# Altium project MC Alarm.PrjPcb (part 1 of 2)
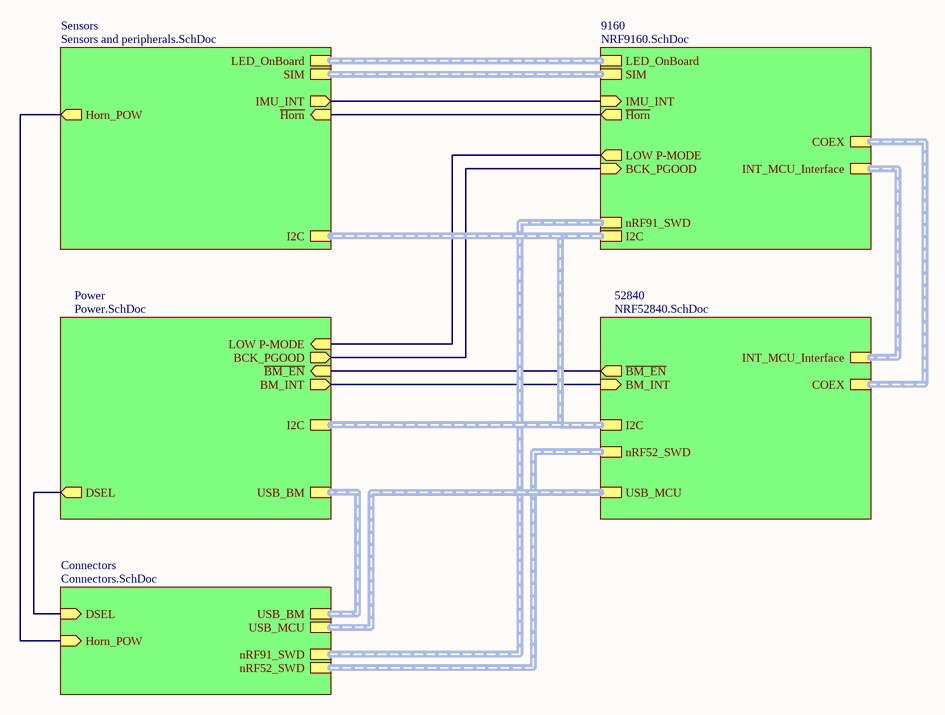
[diagram p0: Main.SchDoc]
6 sheets, 176 parts. Net scope: hierarchical (ports join the sheet entries above them; power ports are global).
Board files: PCB.PcbDoc, PCB - v2.PcbDoc, PCB - v3.PcbDoc, PCB - v4.PcbDoc
Sheets:
  Main.SchDoc
    Power = Power.SchDoc
    9160 = NRF9160.SchDoc
    52840 = NRF52840.SchDoc
    Sensors = Sensors and peripherals.SchDoc
    Connectors = Connectors.SchDoc

## Sheet Main.SchDoc
size A4; CompanyName: Motonaut Electronics; DrawnBy: Simon; SheetNumber: 1; SheetTotal: 6

### Sub-sheets
9160 = NRF9160.SchDoc: I2C (harness I2C), nRF91_SWD (harness SWD), LED_OnBoard (harness LED_CTRL), ~{Horn} (out), COEX (harness COEX), IMU_INT (in), SIM (harness SIM), LOW P-MODE (out), BCK_PGOOD (in), INT_MCU_Interface (harness USB)
52840 = NRF52840.SchDoc: I2C (harness I2C), USB_MCU (harness USB), nRF52_SWD (harness SWD), COEX (harness COEX), INT_MCU_Interface (harness USB), BM_INT (in), ~{BM_EN} (out)
Connectors = Connectors.SchDoc: nRF52_SWD (harness SWD), nRF91_SWD (harness SWD), Horn_POW (in), USB_BM (harness USB), USB_MCU (harness USB), DSEL (in)
Power = Power.SchDoc: I2C (harness I2C), LOW P-MODE (in), BCK_PGOOD (out), ~{BM_EN} (in), BM_INT (out), USB_BM (harness USB), DSEL (out)
Sensors = Sensors and peripherals.SchDoc: LED_OnBoard (harness LED_CTRL), ~{Horn} (in), IMU_INT (out), SIM (harness SIM), I2C (harness I2C), Horn_POW (out)

### Nets
~{BM_EN}: sheet Power/~{BM_EN}, sheet 52840/~{BM_EN}
BCK P_GOOD: sheet Power/BCK_PGOOD, sheet 9160/BCK_PGOOD
BM_INT: sheet Power/BM_INT, sheet 52840/BM_INT
DSEL: sheet Power/DSEL, sheet Connectors/DSEL
~{Horn}: sheet 9160/~{Horn}, sheet Sensors/~{Horn}
INT_IMU: sheet 9160/IMU_INT, sheet Sensors/IMU_INT
LOW P-MODE: sheet Power/LOW P-MODE, sheet 9160/LOW P-MODE
NetE1_A1: sheet Sensors/Horn_POW, sheet Connectors/Horn_POW

### Buses and harness runs
harness sheet 9160/COEX = sheet 52840/COEX
harness sheet 9160/I2C = sheet 52840/I2C = sheet Power/I2C = sheet Sensors/I2C
harness sheet 9160/INT_MCU_Interface = sheet 52840/INT_MCU_Interface
harness sheet 9160/LED_OnBoard = sheet Sensors/LED_OnBoard
harness sheet 9160/nRF91_SWD = sheet Connectors/nRF91_SWD
harness sheet 9160/SIM = sheet Sensors/SIM
harness sheet 52840/nRF52_SWD = sheet Connectors/nRF52_SWD
harness sheet 52840/USB_MCU = sheet Connectors/USB_MCU
harness sheet Connectors/USB_BM = sheet Power/USB_BM

## Sheet Power.SchDoc: OnTrack Power
size A3; Date: 2022-06; DrawnBy: Simon Björklund; Engineer: Simon Björklund; Organization: ETA; Revision: 3; SheetNumber: 3; SheetTotal: 6
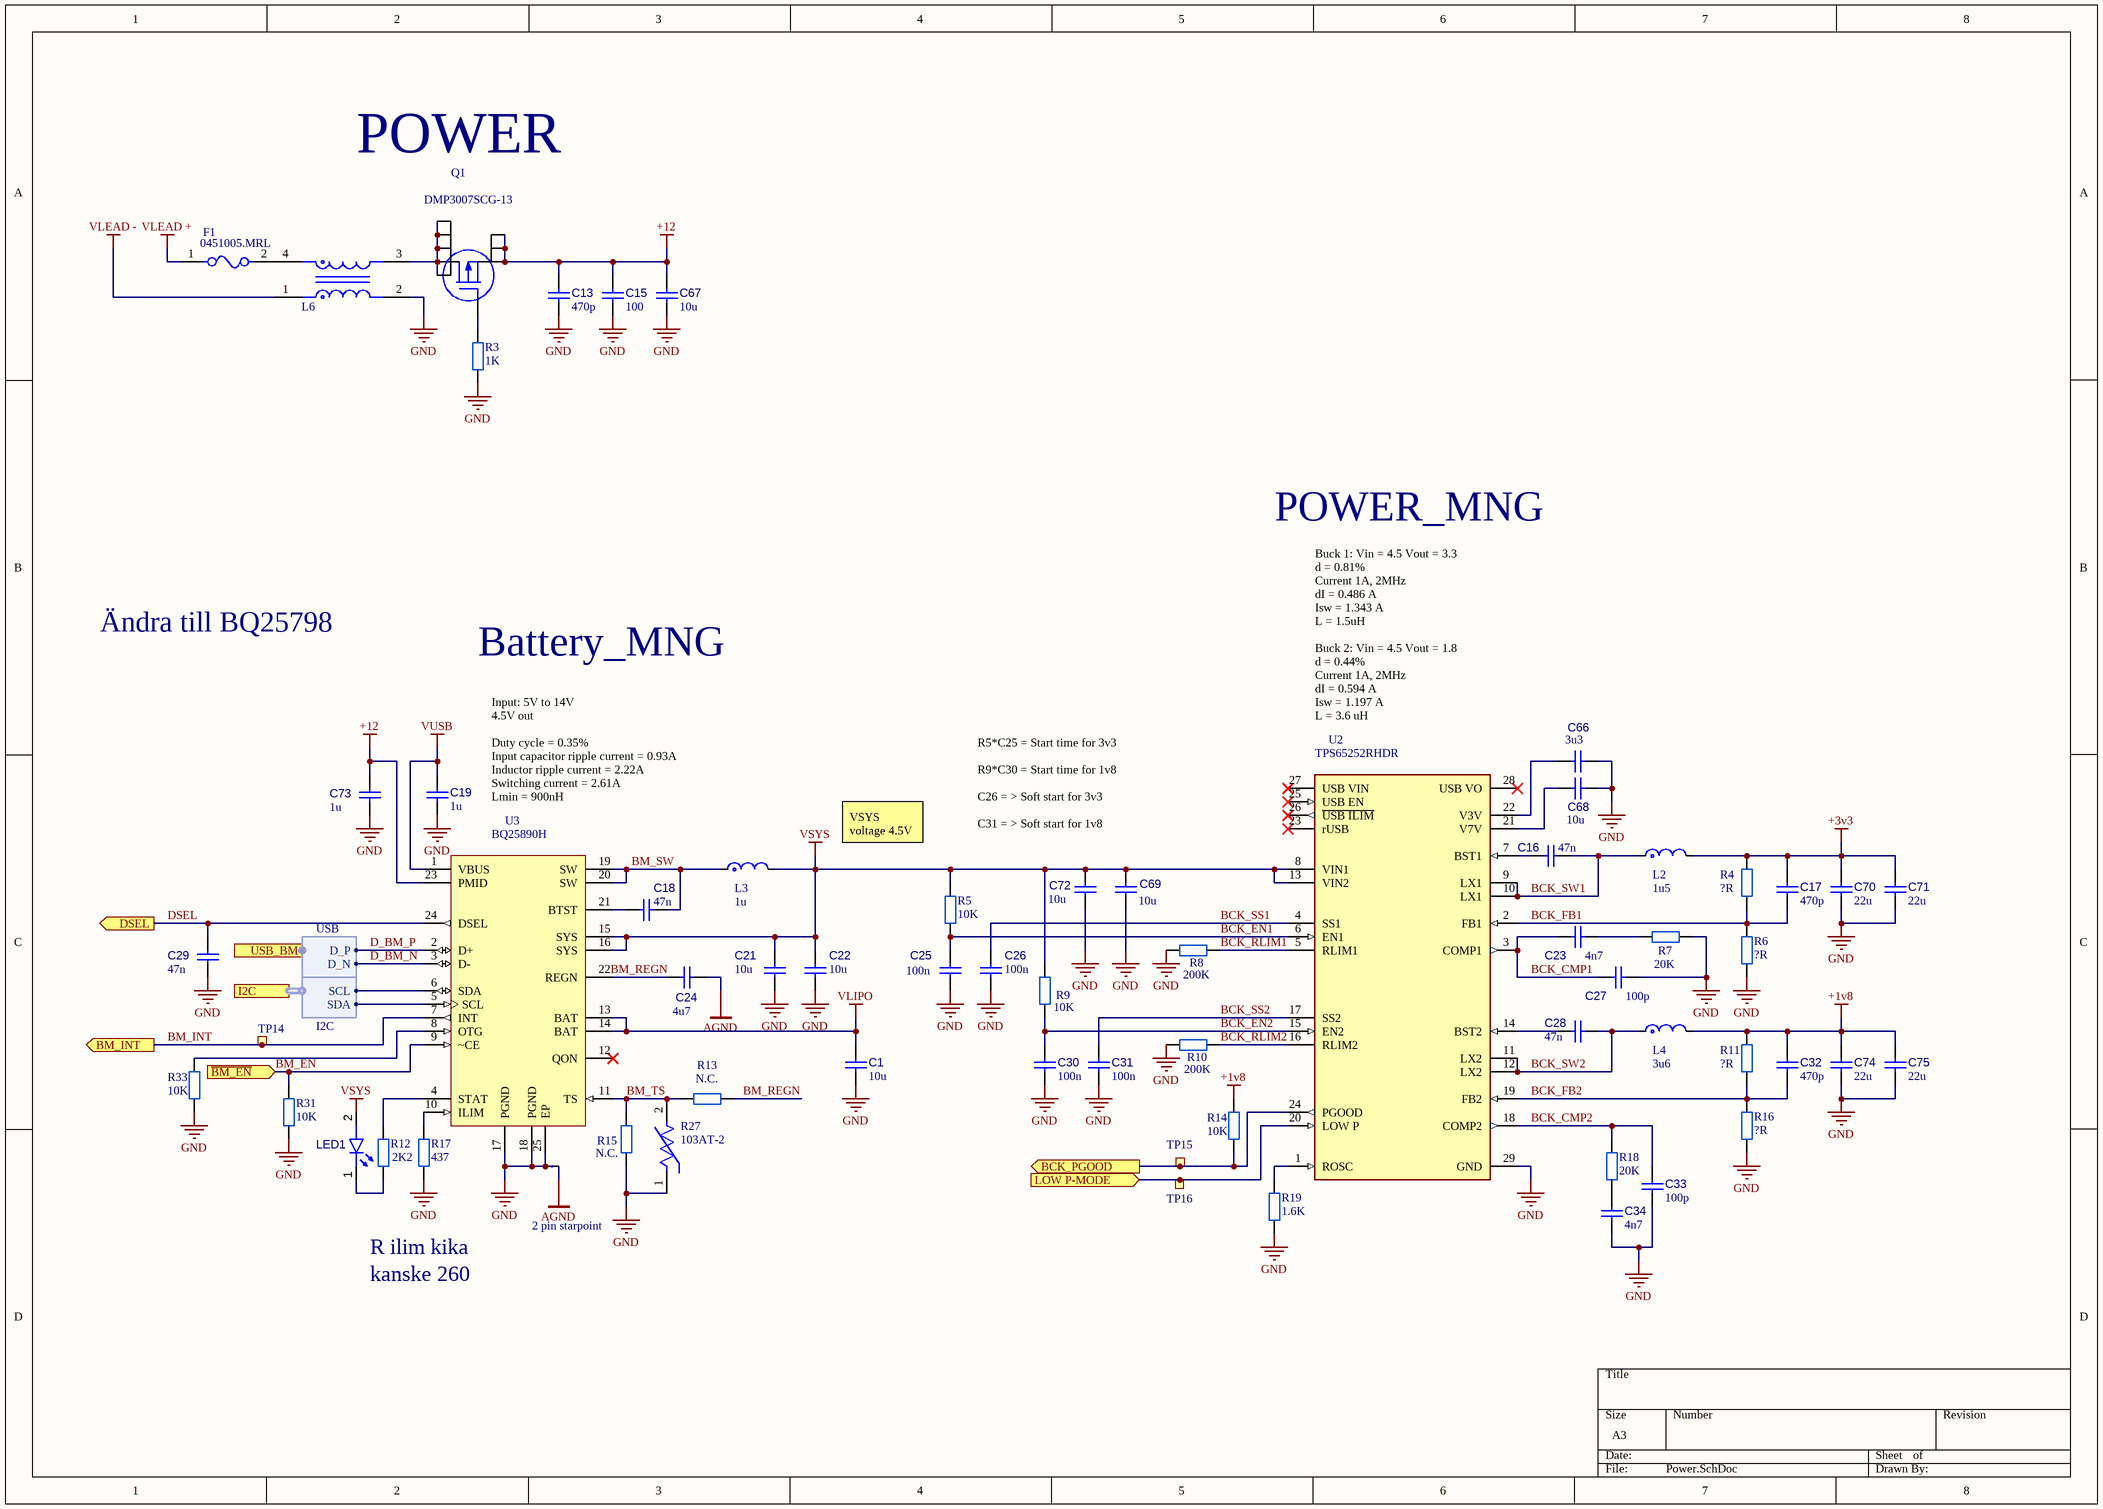
[diagram p1: Power.SchDoc]

### Parts
C1  value 10u  [CAPC1608X90X40LL10T20 HD]  (hidden comment: Capacitor 0603)
C13  value 470p  [CAPC2013X95X50LL10T25 HD]  (hidden comment: Capacitor 0805)
C15  value 100  [CAPC1608X90X40LL10T20 HD]  (hidden comment: Capacitor 0603)
C16  value 47n  [CAPC1005X55X25LL05T10 HD]  (hidden comment: Capacitor 0402)
C17  value 470p  [CAPC1005X55X25LL05T10 HD]  (hidden comment: Capacitor 0402)
C18  value 47n  [CAPC1005X55X25LL05T10 HD]  (hidden comment: Capacitor 0402)
C19  value 1u  [CAPC1005X55X25LL05T10 HD]  (hidden comment: Capacitor 0402)
C21  value 10u  [CAPC1608X90X40LL10T20 HD]  (hidden comment: Capacitor 0603)
C22  value 10u  [CAPC1608X90X40LL10T20 HD]  (hidden comment: Capacitor 0603)
C23  value 4n7  [CAPC1005X55X25LL05T10 HD]  (hidden comment: Capacitor 0402)
C24  value 4u7  [CAPC1608X90X40LL10T20 HD]  (hidden comment: Capacitor 0603)
C25  value 100n  [CAPC1005X55X25LL05T10 HD]  (hidden comment: Capacitor 0402)
C26  value 100n  [CAPC1005X55X25LL05T10 HD]  (hidden comment: Capacitor 0402)
C27  value 100p  [CAPC1005X55X25LL05T10 HD]  (hidden comment: Capacitor 0402)
C28  value 47n  [CAPC1005X55X25LL05T10 HD]  (hidden comment: Capacitor 0402)
C29  value 47n  [CAPC1005X55X25LL05T10 HD]  (hidden comment: Capacitor 0402)
C30  value 100n  [CAPC1005X55X25LL05T10 HD]  (hidden comment: Capacitor 0402)
C31  value 100n  [CAPC1005X55X25LL05T10 HD]  (hidden comment: Capacitor 0402)
C32  value 470p  [CAPC1005X55X25LL05T10 HD]  (hidden comment: Capacitor 0402)
C33  value 100p  [CAPC1005X55X25LL05T10 HD]  (hidden comment: Capacitor 0402)
C34  value 4n7  [CAPC1005X55X25LL05T10 HD]  (hidden comment: Capacitor 0402)
C66  value 3u3  [CAPC1608X90X40LL10T20 HD]  (hidden comment: Capacitor 0603)
C67  value 10u  [CAPC1608X90X40LL10T20 HD]  (hidden comment: Capacitor 0603)
C68  value 10u  [CAPC1608X90X40LL10T20 HD]  (hidden comment: Capacitor 0603)
C69  value 10u  [CAPC1608X90X40LL10T20 HD]  (hidden comment: Capacitor 0603)
C70  value 22u  [CAPC1608X90X40LL10T20 HD]  (hidden comment: Capacitor 0603)
C71  value 22u  [CAPC1608X90X40LL10T20 HD]  (hidden comment: Capacitor 0603)
C72  value 10u  [CAPC1608X90X40LL10T20 HD]  (hidden comment: Capacitor 0603)
C73  value 1u  [CAPC1005X55X25LL05T10 HD]  (hidden comment: Capacitor 0402)
C74  value 22u  [CAPC1608X90X40LL10T20 HD]  (hidden comment: Capacitor 0603)
C75  value 22u  [CAPC1608X90X40LL10T20 HD]  (hidden comment: Capacitor 0603)
F1  0451005.MRL  [FP-0451-MFG]
L2  value 1u5  [INDC2013X105X50NL20T20]  (hidden comment: Inductor 0805)
L3  Inductance: 1u  [INDC2013X105X50NL20T20]  (hidden comment: Inductor 0805)
L4  value 3u6  [INDC2013X105X50NL20T20]  (hidden comment: Inductor 0805)
L6  DLW5ATN231TQ2L  [FP-DLW5A-MFG]  (value not drawn)
LED1  QBLP595-R  [QTB-QBLP595_V]  (value not drawn)
Q1  DMP3007SCG-13  [DMP3007SCG13]
R3  value 1K  [RESC1005X40X25LL10T10 HD]  (hidden comment: Resistor 0403)
R4  value ?R  [RESC1005X40X25LL10T10 HD]  (hidden comment: Resistor 0403)
R5  value 10K  [RESC1005X40X25LL10T10 HD]  (hidden comment: Resistor 0403)
R6  value ?R  [RESC1005X40X25LL10T10 HD]  (hidden comment: Resistor 0403)
R7  value 20K  [RESC1005X40X25LL10T10 HD]  (hidden comment: Resistor 0403)
R8  value 200K  [RESC1005X40X25LL10T10 HD]  (hidden comment: Resistor 0403)
R9  value 10K  [RESC1005X40X25LL10T10 HD]  (hidden comment: Resistor 0403)
R10  value 200K  [RESC1005X40X25LL10T10 HD]  (hidden comment: Resistor 0403)
R11  value ?R  [RESC1005X40X25LL10T10 HD]  (hidden comment: Resistor 0403)
R12  value 2K2  [RESC1005X40X25LL10T10 HD]  (hidden comment: Resistor 0403)
R13  value N.C.  [RESC1005X40X25LL10T10 HD]  (hidden comment: Resistor 0403)
R14  value 10K  [RESC1005X40X25LL10T10 HD]  (hidden comment: Resistor 0403)
R15  value N.C.  [RESC1005X40X25LL10T10 HD]  (hidden comment: Resistor 0403)
R16  value ?R  [RESC1005X40X25LL10T10 HD]  (hidden comment: Resistor 0403)
R17  value 437  [RESC1005X40X25LL10T10 HD]  (hidden comment: Resistor 0403)
R18  value 20K  [RESC1005X40X25LL10T10 HD]  (hidden comment: Resistor 0403)
R19  value 1.6K  [RESC1005X40X25LL10T10 HD]  (hidden comment: Resistor 0403)
R27  103AT-2  [FP-103AT-2-MFG]
R31  value 10K  [RESC1005X40X25LL10T10 HD]  (hidden comment: Resistor 0403)
R33  value 10K  [RESC1005X40X25LL10T10 HD]  (hidden comment: Resistor 0403)
ST1  2 pin starpoint  [2 PIN STARPOINT]  (net tie, no BOM)
TP14  TP_SMD_Ø0.7MM  [TP_SMD_Ø0.7mm]  (value not drawn)  (no BOM)
TP15  TP_SMD_Ø0.7MM  [TP_SMD_Ø0.7mm]  (value not drawn)  (no BOM)
TP16  TP_SMD_Ø0.7MM  [TP_SMD_Ø0.7mm]  (value not drawn)  (no BOM)
U2  TPS65252RHDR  [FP-RHD0028A-MFG]
U3  BQ25890H  [QFN50P400X400X80-25N-D]

### Ports
BCK_PGOOD (out), BM_INT (out), DSEL (out), I2C (harness I2C), LOW P-MODE (in), USB_BM (harness USB), ~{BM_EN} (in)

### Harnesses
I2C: SCL, SDA
USB: D_P, D_N

### Nets
+1v8: C32.2 C74.2 C75.2 L4.2 R11.2 R14.2
+3v3: C17.2 C70.2 C71.2 L2.2 R4.2
+12: C13.2 C15.2 C67.2 C73.2 Q1.1(S) Q1.2(S) Q1.3(S) U3.23(PMID)
AGND: C24.2 ST1.2
GND: C1.1 C13.1 C15.1 C19.1 C21.1 C22.1 C25.1 C26.1 C27.1 C29.1 C30.1 C31.1 C33.1 C34.1 C66.1 C67.1 C68.1 C69.1 C70.1 C71.1 C72.1 C73.1 C74.1 C75.1 L6.2 R3.1 R6.1 R7.2 R8.1 R10.1 R15.1 R16.1 R17.1 R19.1 R27.1 R31.1 R33.1 ST1.1 U2.29(GND) U3.17(PGND) U3.18(PGND) U3.25(EP)
VLEAD +: F1.1
VLEAD -: L6.1
VLIPO: C1.2 U3.13(BAT) U3.14(BAT)
VSYS: C21.2 C22.2 C69.2 C72.2 L3.2 LED1.2(A) R5.2 R9.2 U2.8(VIN1) U2.13(VIN2) U3.15(SYS) U3.16(SYS)
VUSB: C19.2 U3.1(VBUS)
BCK P_GOOD: R14.1 TP15.1 U2.24(PGOOD) ; port BCK_PGOOD
BCK_CMP1: C23.1 C27.2 U2.3(COMP1)
BCK_CMP2: C33.2 R18.2 U2.18(COMP2)
BCK_EN1: C25.2 R5.1 U2.6(EN1)
BCK_EN2: C30.2 R9.1 U2.15(EN2)
BCK_FB1: C17.1 R4.1 R6.2 U2.2(FB1)
BCK_FB2: C32.1 R11.1 R16.2 U2.19(FB2)
BCK_RLIM1: R8.2 U2.5(RLIM1)
BCK_RLIM2: R10.2 U2.16(RLIM2)
BCK_SS1: C26.2 U2.4(SS1)
BCK_SS2: C31.2 U2.17(SS2)
BCK_SW1: C16.2 L2.1 U2.9(LX1) U2.10(LX1)
BCK_SW2: C28.2 L4.1 U2.11(LX2) U2.12(LX2)
BM_~{EN}: R31.2 U3.9(~CE) ; port ~{BM_EN}  [project net ~{BM_EN}]
BM_INT: TP14.1 U3.7(INT) ; port BM_INT
BM_REGN: C24.1 R13.2 U3.22(REGN)
BM_SW: C18.2 L3.1 U3.19(SW) U3.20(SW)
BM_TS: R13.1 R15.2 R27.2 U3.11(TS)
D_BM_N: U3.3(D-) ; port USB_BM.D_N
D_BM_P: U3.2(D+) ; port USB_BM.D_P
DSEL: C29.2 U3.24(DSEL) ; port DSEL
LOW P-MODE: TP16.1 U2.20(LOW_P) ; port LOW P-MODE
SCL: U3.6(SDA) ; port I2C.SCL
SDA: U3.5(SCL) ; port I2C.SDA
NetC16_1: C16.1 U2.7(BST1)
NetC18_1: C18.1 U3.21(BTST)
NetC23_2: C23.2 R7.1
NetC28_1: C28.1 U2.14(BST2)
NetC34_2: C34.2 R18.1
NetC66_2: C66.2 U2.22(V3V)
NetC68_2: C68.2 U2.21(V7V)
NetF1_2: F1.2 L6.4
NetL6_3: L6.3 Q1.5(D) Q1.6(D) Q1.7(D) Q1.8(D) Q1.9(D)
NetLED1_1: LED1.1(K) R12.2
NetQ1_4: Q1.4(G) R3.2
NetR12_1: R12.1 U3.4(STAT)
NetR17_2: R17.2 U3.10(ILIM)
NetR19_2: R19.2 U2.1(ROSC)
NetR33_2: R33.2 U3.8(OTG)

Not connected (* = marked no-connect by the designer): U2 23(rUSB)* 25(USB_EN)* 26(~{USB_ILIM})* 27(USB_VIN)* 28(USB_VO)*; U3 12(QON)*

### Notes on the sheet
- POWER
- POWER_MNG
- Ändra till BQ25798
- Buck 1: Vin = 4.5 Vout = 3.3
  d = 0.81%
  Current 1A, 2MHz
  dI = 0.486 A
  Isw = 1.343 A
  L = 1.5uH
- Battery_MNG
- Buck 2: Vin = 4.5 Vout = 1.8
  d = 0.44%
  Current 1A, 2MHz
  dI = 0.594 A
  Isw = 1.197 A
  L = 3.6 uH
- Input: 5V to 14V
  4.5V out
  Duty cycle = 0.35%
  Input capacitor ripple current = 0.93A
  Inductor ripple current = 2.22A
  Switching current = 2.61A
  Lmin = 900nH
- VSYS voltage 4.5V
- R5*C25 = Start time for 3v3
  R9*C30 = Start time for 1v8
  C26 = > Soft start for 3v3
  C31 = > Soft start for 1v8
- R ilim kika
- kanske 260

### Library data of the parts
C1 C15 C21 C22 C24 C66-C72 C74 C75 = CMP-001-00014-13: Chip Capacitor, 0603 (1608 Metric); Voltage Rating: ?V; Tolerance: ?%; Max Operating Temperature: Ceramic; Pins: 2; Case/Package: 0603; Mounting Technology: SMT
C13 = CMP-001-00018-14: Chip Capacitor, 0805 (2012 Metric); Voltage Rating: ?V; Capacitor Type: Ceramic; Tolerance: ?%; Pins: 2; Min Operating Temperature: -55°C; Case/Package: 0805; Mounting Technology: SMT; Max Operating Temperature: 125°C
C16-C18 C23 C27 C28 C32-C34 = CMP-001-00008-14: Chip Capacitor, 0402 (1005 Metric); Capacitor Type: Ceramic; Tolerance: ?%; Voltage Rating: ?V; Pins: 2; Mounting Technology: SMT; Case/Package: 0402
C19 C25 C26 C29-C31 C73 = CMP-001-00008-14: Chip Capacitor, 0402 (1005 Metric); Tolerance: ?%; Capacitor Type: Ceramic; Voltage Rating: ?V; Case/Package: 0402; Pins: 2; Mounting Technology: SMT
F1 = CMP-2000-05653-2: FUSE BRD MNT 5A 125VAC/VDC 2SMD; Manufacturer: Littelfuse Inc; Fuse Blow Speed: Fast; Voltage Rating: 125V; Fuse Interrupt Ac Current: 50A; Value: 0.0125Ω; Fuse I2T: 5.566A2Sec; Device Class L3: unset; Temperature Range Low: -55°C; Height: 2.94mm; Category: Fuse; Fuse Current: 5A; Octopart: https://octopart.com/0451005.mrl-littelfuse-566389; Package: 0451; RoHS: TRUE; Manufacturer Part Number: 0451005.MRL; Mouser Description: Surface Mount Fuses 125V 5A; Device Class L2: Fuses; ComponentLink2URL: https://www.littelfuse.com/~/media/electronics/datasheets/fuses/littelfuse_fuse_451_453_datasheet.pdf.pdf; Temperature Range High: +125°C; Digikey Description: FUSE BRD MNT 5A 125VAC/VDC 2SMD; Device Class L1: Circuit Protection; Automotive: No; Fuse Interrupt Dc Current: 50A; Temperature: -55°C to +125°C; Max Fuse Dc Voltage: 125V; Resistance: 0.0125Ω; ComponentLink2Description: Datasheet; Max Fuse Ac Voltage: 125V; Lead Free: Yes
L2 L4 = CMP-006-00023-4: Inductor RF Chip Thin Film 0805; Current Rating: ?A; Resonant Frequency: ?Hz; Pins: 2
  L2: Inductance: 1u5
  L4: Inductance: 3u6
L3 = CMP-006-00023-4: Inductor RF Chip Thin Film 0805; Current Rating: ?A; Resonant Frequency: ?Hz; Value: ?H; Pins: 2
L6 = CMP-000010-1: Ind Common Mode Choke Wirewound 230 Ohm 100MHz 4A Embossed T/R
LED1 = CMP-007-00040-3: Chip LED 0402, Red, 0.02 A, 2.0 to 2.5 V, -40 to 80 degC, 2-Pin SMD, RoHS, Tape and Reel; Colour: Red; RoHS Compliant: Yes; Case/Package: 0402; Pins: 2; Mounting Technology: SMT
Q1 = CMP-028-000000-2: Trans MOSFET P-CH 30V 50A 8-Pin VDFN EP T/R; Manufacturer_Name: Diodes Inc.; Source: Moto Symbol Lib.SchLib; Height: 0.85mm; Mouser Price/Stock: https://www.mouser.co.uk/ProductDetail/Diodes-Incorporated/DMP3007SCG-13?qs=lqAf%2FiVYw9j1j9A9Mlh%252Bjg%3D%3D; Design Item ID: DMP3007SCG-13; Manufacturer_Part_Number: DMP3007SCG-13; Arrow Price/Stock: https://www.arrow.com/en/products/dmp3007scg-13/diodes-incorporated; Arrow Part Number: DMP3007SCG-13; Mouser Part Number: 621-DMP3007SCG-13; Datasheet Link: https://componentsearchengine.com/Datasheets/1/DMP3007SCG-13.pdf
R3-R19 R31 R33 = CMP-009-00178-4: Package: 0403; Design Item ID: Resistor EU; Source: Moto Symbol Lib.SchLib
R27 = CMP-2000-05824-2: Thermistor NTC 10KOhm 1% 2-Pin; Resistance: 10kR; Lead Pitch: 2.54mm; Height: 2.4mm; Max Operating Temperature: 110°C; Width: 3.7mm; RoHS Compliant: Yes; Min Operating Temperature: -50°C; Termination: Radial; Packaging: Bulk; Number of Pins: 2; Series: AT; Tolerance: 1%; Length: 17mm
ST1 = CMP-026-000001-1: Starpoint; Note: N.A.; Pad Count: 2; Value: N.A.; PartId: 100500603; Source: pca20035.SCHLIB; Design Item ID: 2 pin starpoint; Published: 2017-08-31; HelpURL: N.A.; Manufacturer Part Number: N.A.; Part number IPS: N.A.; Component Type: Net Tie; Component Class: Connectors; ComponentLink1Description: Datasheet; Footprint Doc: N.A.; ComponentLink1URL: N.A.; Manufacturer: N.A.; ComponentLink2Description: Supplier link; Pin Count: 2; ComponentLink2URL: N.A.; LatestRevisionDate: 2017-08-31; Part Number: 2 pin starpoint; Artikkelnr Noca: N.A.
TP14-TP16 = CMP-025-000000-1: 0.7mm circular SMD testpad; Manufacturer: Nordic Semiconductor; Artikkelnr Noca: N.A.; Value: Ø0.7mm,SMD; Pad Count: 1; ComponentLink1Description: Datasheet; Component Class: Connectors; Part Number: TP_SMD_Ø0.7MM; HelpURL: N.A.; Source: pca20035.SCHLIB; Published: 2017-12-14; ComponentLink1URL: N.A.; Note: N.A.; Pin Count: 1; Component Type: Standard (No BOM); Design Item ID: TP_SMD_Ø0.7MM; Part number IPS: N.A.; PartId: 100500474; LatestRevisionDate: 2017-12-14; Manufacturer Part Number: N.A.; ComponentLink2URL: N.A.; ComponentLink2Description: Supplier link; Footprint Doc: TP_SMD_Ø0.7mm
U2 = CMP-019-00049-6: TPS65252 4.5V to 16V Input, 3A/2
U3 = CMP-010-000003-3: BQ25890H I2C Controlled Single Cell 5-A Fast Charger with MaxChargeTM Technology for High Input Voltage and Adjustable Voltage USB On-the-Go Boost Mode; Design Item ID: BQ25890H; Source: Moto Symbol Lib.SchLib

## Sheet NRF9160.SchDoc
size A3; SheetNumber: 2; SheetTotal: 6
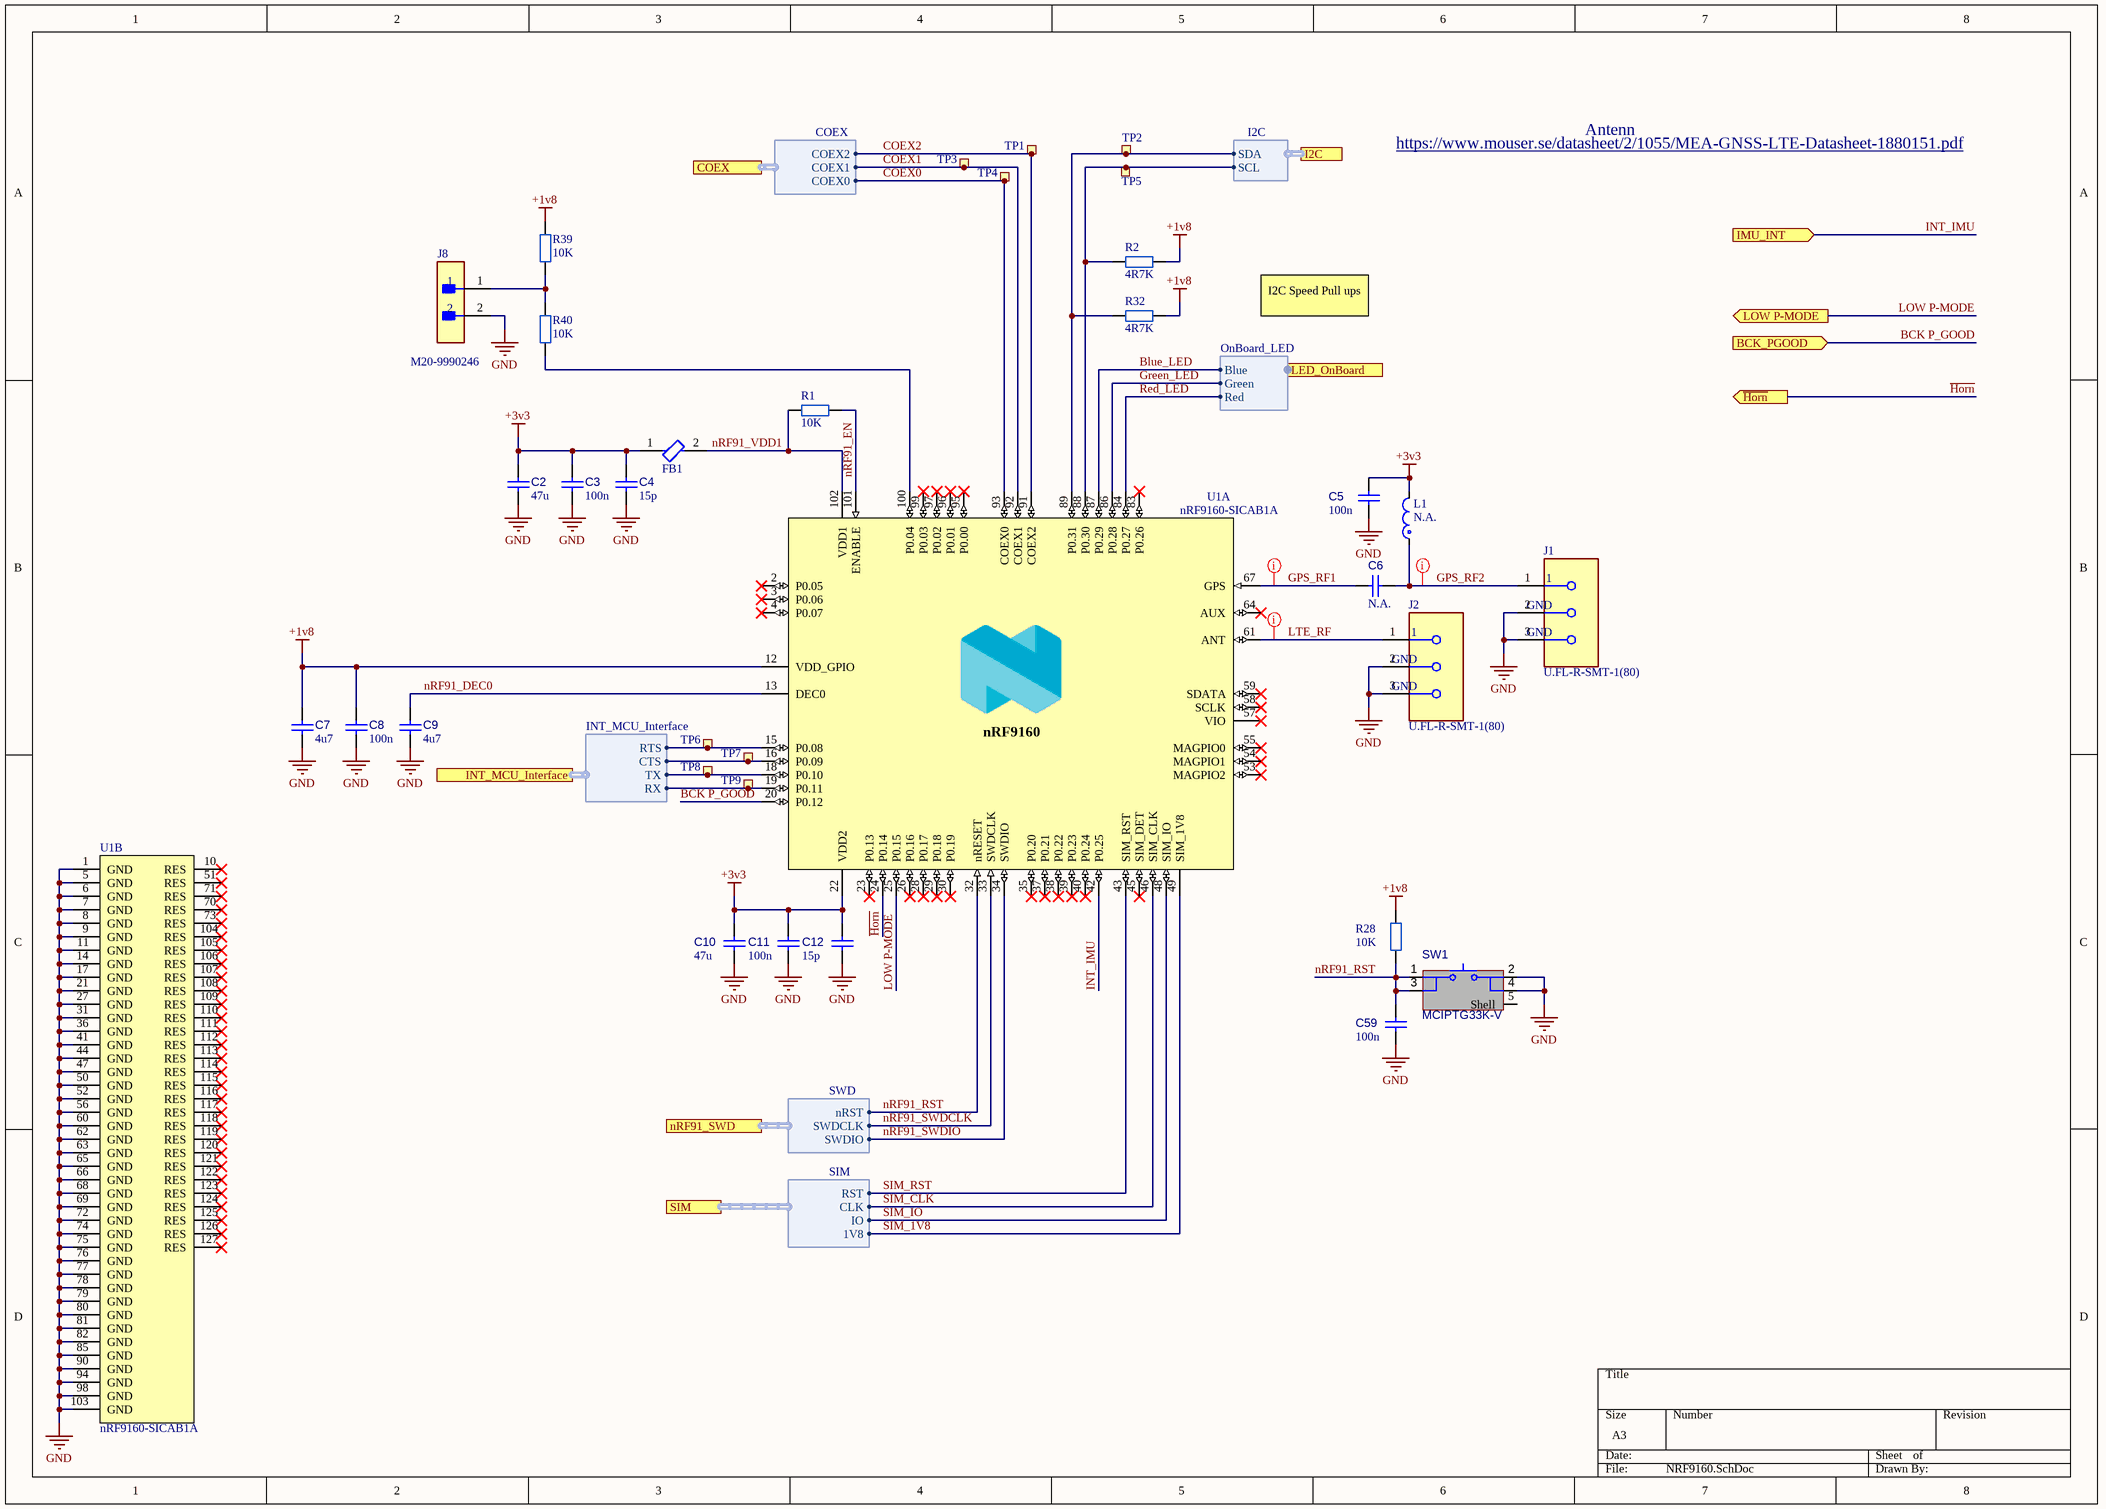
[diagram p2: NRF9160.SchDoc]

### Parts
C2  value 47u  [CAPC2013X95X50LL10T25 HD]  (hidden comment: Capacitor 0805)
C3  value 100n  [CAPC1005X55X25LL05T10 HD]  (hidden comment: Capacitor 0402)
C4  value 15p  [CAPC1005X55X25LL05T10 HD]  (hidden comment: Capacitor 0402)
C5  value 100n  [CAPC1005X55X25LL05T10 HD]  (hidden comment: Capacitor 0402)
C6  value N.A.  [CAPC1005X55X25LL05T10 HD]  (hidden comment: Capacitor 0402)
C7  value 4u7  [CAPC1608X90X40LL10T20 HD]  (hidden comment: Capacitor 0603)
C8  value 100n  [CAPC1005X55X25LL05T10 HD]  (hidden comment: Capacitor 0402)
C9  value 4u7  [CAPC1608X90X40LL10T20 HD]  (hidden comment: Capacitor 0603)
C10  value 47u  [CAPC2013X95X50LL10T25 HD]  (hidden comment: Capacitor 0805)
C11  value 100n  [CAPC1005X55X25LL05T10 HD]  (hidden comment: Capacitor 0402)
C12  value 15p  [CAPC1005X55X25LL05T10 HD]  (hidden comment: Capacitor 0402)
C59  value 100n  [CAPC1005X55X25LL05T10 HD]  (hidden comment: Capacitor 0402)
FB1  BLM15PX121SN1D  [FP-BLM15-0_05-d0_7-IPC_A]  (value not drawn)
J1  U.FL-R-SMT-1(80)  [FP-U_FL-R-SMT-1_80-MFG]
J2  U.FL-R-SMT-1(80)  [FP-U_FL-R-SMT-1_80-MFG]
J8  M20-9990246  [FP-M20-9990246-MFG]
L1  value N.A.  [INDC1005X55X25LL05T10_A]  (hidden comment: Inductor 0402)
R1  value 10K  [RESC1005X40X25LL10T10 HD]  (hidden comment: Resistor 0403)
R2  value 4R7K  [RESC1005X40X25LL10T10 HD]  (hidden comment: Resistor 0403)
R28  value 10K  [RESC1005X40X25LL10T10 HD]  (hidden comment: Resistor 0403)
R32  value 4R7K  [RESC1005X40X25LL10T10 HD]  (hidden comment: Resistor 0403)
R39  value 10K  [RESC1005X40X25LL10T10 HD]  (hidden comment: Resistor 0403)
R40  value 10K  [RESC1005X40X25LL10T10 HD]  (hidden comment: Resistor 0403)
SW1  MCIPTG33K-V  [MCIPTG33K-V-Footprint-1]
TP1  TP_SMD_Ø0.7MM  [TP_SMD_Ø0.7mm]  (value not drawn)  (no BOM)
TP2  TP_SMD_Ø0.7MM  [TP_SMD_Ø0.7mm]  (value not drawn)  (no BOM)
TP3  TP_SMD_Ø0.7MM  [TP_SMD_Ø0.7mm]  (value not drawn)  (no BOM)
TP4  TP_SMD_Ø0.7MM  [TP_SMD_Ø0.7mm]  (value not drawn)  (no BOM)
TP5  TP_SMD_Ø0.7MM  [TP_SMD_Ø0.7mm]  (value not drawn)  (no BOM)
TP6  TP_SMD_Ø0.7MM  [TP_SMD_Ø0.7mm]  (value not drawn)  (no BOM)
TP7  TP_SMD_Ø0.7MM  [TP_SMD_Ø0.7mm]  (value not drawn)  (no BOM)
TP8  TP_SMD_Ø0.7MM  [TP_SMD_Ø0.7mm]  (value not drawn)  (no BOM)
TP9  TP_SMD_Ø0.7MM  [TP_SMD_Ø0.7mm]  (value not drawn)  (no BOM)
U1  nRF9160-SICAB1A  [LGA50P1600X1050X104-161N]  (parts A,B of 2)

### Ports
BCK_PGOOD (in), COEX (harness COEX), I2C (harness I2C), IMU_INT (in), INT_MCU_Interface (harness INT_MCU_Interface), LED_OnBoard (harness OnBoard_LED), LOW P-MODE (out), nRF91_SWD (harness SWD), SIM (harness SIM), ~{Horn} (out)

### Harnesses
SIM: RST, CLK, IO, 1V8
SWD: nRST, SWDCLK, SWDIO
COEX: COEX0, COEX1, COEX2
I2C: SDA, SCL
INT_MCU_Interface: RTS, CTS, TX, RX
OnBoard_LED: Blue, Green, Red

### Nets
+1v8: C7.2 C8.2 R2.2 R28.2 R32.2 R39.1 U1.12(VDD_GPIO)
+3v3: C2.2 C3.2 C4.2 C5.1 C10.2 C11.2 C12.2 FB1.1 L1.2 U1.22(VDD2)
GND: C2.1 C3.1 C4.1 C5.2 C7.1 C8.1 C9.1 C10.1 C11.1 C12.1 C59.1 J1.2(GND) J1.3(GND) J2.2(GND) J2.3(GND) J8.2 SW1.2 SW1.4 U1.1(GND) U1.5(GND) U1.6(GND) U1.7(GND) U1.8(GND) U1.9(GND) U1.11(GND) U1.14(GND) U1.17(GND) U1.21(GND) U1.27(GND) U1.31(GND) U1.36(GND) U1.41(GND) U1.44(GND) U1.47(GND) U1.50(GND) U1.52(GND) U1.56(GND) U1.60(GND) U1.62(GND) U1.63(GND) U1.65(GND) U1.66(GND) U1.68(GND) U1.69(GND) U1.72(GND) U1.74(GND) U1.75(GND) U1.76(GND) U1.77(GND) U1.78(GND) U1.79(GND) U1.80(GND) U1.81(GND) U1.82(GND) U1.85(GND) U1.90(GND) U1.94(GND) U1.98(GND) U1.103(GND)
BCK P_GOOD: U1.20(P0.12) ; port BCK_PGOOD
Blue_LED: U1.87(P0.29) ; port LED_OnBoard.Blue
COEX0: TP4.1 U1.93(COEX0) ; port COEX.COEX0
COEX1: TP3.1 U1.92(COEX1) ; port COEX.COEX1
COEX2: TP1.1 U1.91(COEX2) ; port COEX.COEX2
CTS_INT_MCU: TP7.1 U1.16(P0.09) ; port INT_MCU_Interface.CTS
GPS_RF1: C6.2 U1.67(GPS)
GPS_RF2: C6.1 J1.1 L1.1
Green_LED: U1.86(P0.28) ; port LED_OnBoard.Green
~{Horn}: U1.24(P0.14) ; port ~{Horn}
INT_IMU: U1.42(P0.25) ; port IMU_INT
LOW P-MODE: U1.25(P0.15) ; port LOW P-MODE
LTE_RF: J2.1 U1.61(ANT)
nRF91_DEC0: C9.2 U1.13(DEC0)
nRF91_EN: R1.1 U1.101(ENABLE)
nRF91_RST: C59.2 R28.1 SW1.1 SW1.3 U1.32(nRESET) ; port nRF91_SWD.nRST
nRF91_SWDCLK: U1.33(SWDCLK)
nRF91_SWDIO: U1.34(SWDIO)
nRF91_VDD1: FB1.2 R1.2 U1.102(VDD1)
Red_LED: U1.84(P0.27) ; port LED_OnBoard.Red
RTS_INT_MCU: TP6.1 U1.15(P0.08) ; port INT_MCU_Interface.RTS
RX_INT_MCU: TP9.1 U1.19(P0.11) ; port INT_MCU_Interface.RX
SCL: R2.1 TP5.1 U1.88(P0.30) ; port I2C.SCL
SDA: R32.1 TP2.1 U1.89(P0.31) ; port I2C.SDA
SIM_1V8: U1.49(SIM_1V8) ; port SIM.1V8
SIM_CLK: U1.46(SIM_CLK) ; port SIM.CLK
SIM_IO: U1.48(SIM_IO) ; port SIM.IO
SIM_RST: U1.43(SIM_RST) ; port SIM.RST
TX_INT_MCU: TP8.1 U1.18(P0.10) ; port INT_MCU_Interface.TX
NetJ8_1: J8.1 R39.2 R40.2
NetR40_1: R40.1 U1.100(P0.04)

Not connected (* = marked no-connect by the designer): SW1 5(Shell); U1 2(P0.05)* 3(P0.06)* 4(P0.07)* 10(RES)* 23(P0.13)* 26(P0.16)* 28(P0.17)* 29(P0.18)* 30(P0.19)* 35(P0.20)* 37(P0.21)* 38(P0.22)* 39(P0.23)* 40(P0.24)* 45(SIM_DET)* 51(RES)* 53(MAGPIO2)* 54(MAGPIO1)* 55(MAGPIO0)* 57(VIO)* 58(SCLK)* 59(SDATA)* 64(AUX)* 70(RES)* 71(RES)* 73(RES)* 83(P0.26)* 95(P0.00)* 96(P0.01)* 97(P0.02)* 99(P0.03)* 104(RES)* 105(RES)* 106(RES)* 107(RES)* 108(RES)* 109(RES)* 110(RES)* 111(RES)* 112(RES)* 113(RES)* 114(RES)* 115(RES)* 116(RES)* 117(RES)* 118(RES)* 119(RES)* 120(RES)* 121(RES)* 122(RES)* 123(RES)* 124(RES)* 125(RES)* 126(RES)* 127(RES)*

### Layout directives
net class RF: GPS_RF1, GPS_RF2, LTE_RF

### Notes on the sheet
- https://www.mouser.se/datasheet/2/1055/MEA-GNSS-LTE-Datasheet-1880151.pdf
- Antenn
- I2C Speed Pull ups
- (in symbol CMP-026-000000-2, part A) nRF9160

### Library data of the parts
C2 C10 = CMP-001-00018-14: as C13 on sheet Power; Pins: 2; Min Operating Temperature: -55°C; Case/Package: 0805; Mounting Technology: SMT; Max Operating Temperature: 125°C
C3-C6 C8 C11 C12 C59 = CMP-001-00008-14: as C19 on sheet Power; Case/Package: 0402; Pins: 2; Mounting Technology: SMT
C7 C9 = CMP-001-00014-13: as C1 on sheet Power; Max Operating Temperature: Ceramic; Pins: 2; Case/Package: 0603; Mounting Technology: SMT
FB1 = CMP-006-00021-1: Ferrite Beads Multi-Layer 120Ohm 25% 100MHz 2A 0.055Ohm DCR 0402 T/R
J1 J2 = CMP-000007-1: CONN U.FL RCPT STR 50 OHM SMD
J8 = CMP-15831-000009-1: CONN HEADER VERT 2POS 2.54MM; Manufacturer: Harwin; Conn Gender: Male; Conn Orientation: Vertical; Number Of Contacts: 2; Current Rating: 3A; ComponentLink2URL: https://cdn.harwin.com/pdfs/M20-999.pdf; ComponentLink2Description: Datasheet; Package: M20-9990246; Temperature: -40°C to +105°C; Octopart: https://octopart.com/m20-9990246-harwin-2590635; Mouser Description: 2.54mm (0.1") Pitch SIL Vertical PC Tail Pin Header, 6.1mm mating pin height, tin, 2 contacts; Temperature Range High: +105°C; Device Class L1: Connectors; RoHS: TRUE; Automotive: No; Height: 8.99mm; Number Of Rows: 1; Contact Material: Tin,Nickel; Category: Conn; Pitch: 2.54mm; Lead Free: Yes; Digikey Description: CONN HEADER VERT 2POS 2.54MM; Manufacturer Part Number: M20-9990246; Temperature Range Low: -40°C; Device Class L3: unset; Device Class L2: Headers and Wire Housings
L1 = CMP-000000-6: Inductor RF Chip Thin Film 0402; Current Rating: ?A; Resonant Frequency: ?Hz; Inductance: N.A.; Pins: 2
R1 R2 R28 R32 R39 R40 = CMP-009-00178-4: Package: 0403; Design Item ID: Resistor EU; Source: Moto Symbol Lib.SchLib
SW1 = CMP-011-00014-2: The MCIPTG33K-V is a Tactile Switch with solder terminal. The 2.8 x 3.8mm vertical push series switch has silver plated stainless steel contact, high-temperature thermoplastic LCP stem and silver plated stainless steel cover.; ComponentLink1URL: https://www.farnell.com/datasheets/3167256.pdf; ComponentLink1Description: Link
TP1-TP9 = CMP-025-000000-1: as TP14 on sheet Power; ComponentLink1Description: Datasheet; Component Class: Connectors; Part Number: TP_SMD_Ø0.7MM; HelpURL: N.A.; Source: pca20035.SCHLIB; Published: 2017-12-14; ComponentLink1URL: N.A.; Note: N.A.; Pin Count: 1; Component Type: Standard (No BOM); Design Item ID: TP_SMD_Ø0.7MM; Part number IPS: N.A.; PartId: 100500474; LatestRevisionDate: 2017-12-14; Manufacturer Part Number: N.A.; ComponentLink2URL: N.A.; ComponentLink2Description: Supplier link; Footprint Doc: TP_SMD_Ø0.7mm
U1 = CMP-026-000000-2: Low power System-in-Package with integrated LTE-M/NB-IoT modem and GPS; Part number IPS: 80000002329; Manufacturer: Nordic Semiconductor; Artikkelnr Noca: N.A.; Pad Count: 161; HelpURL: N.A.; Source: pca20035.SCHLIB; Value: nRF9160-SICAB1A; Part Number: nRF9160-SICAB1A; PartId: 102000165; Component Class: nRF_Devices; Manufacturer Part Number: nRF9160-SICAB1A; ComponentLink1URL: N.A.; Footprint Doc: LGA-161; Published: 2020-08-13; Design Item ID: nRF9160-SICAB1A; Note: N.A.; ComponentLink1Description: Datasheet; Component Type: Standard; LatestRevisionDate: 2020-08-13; ComponentLink2URL: N.A.; Pin Count: 127; ComponentLink2Description: Supplier link

## Sheet NRF52840.SchDoc
size A3; SheetNumber: 6; SheetTotal: 6
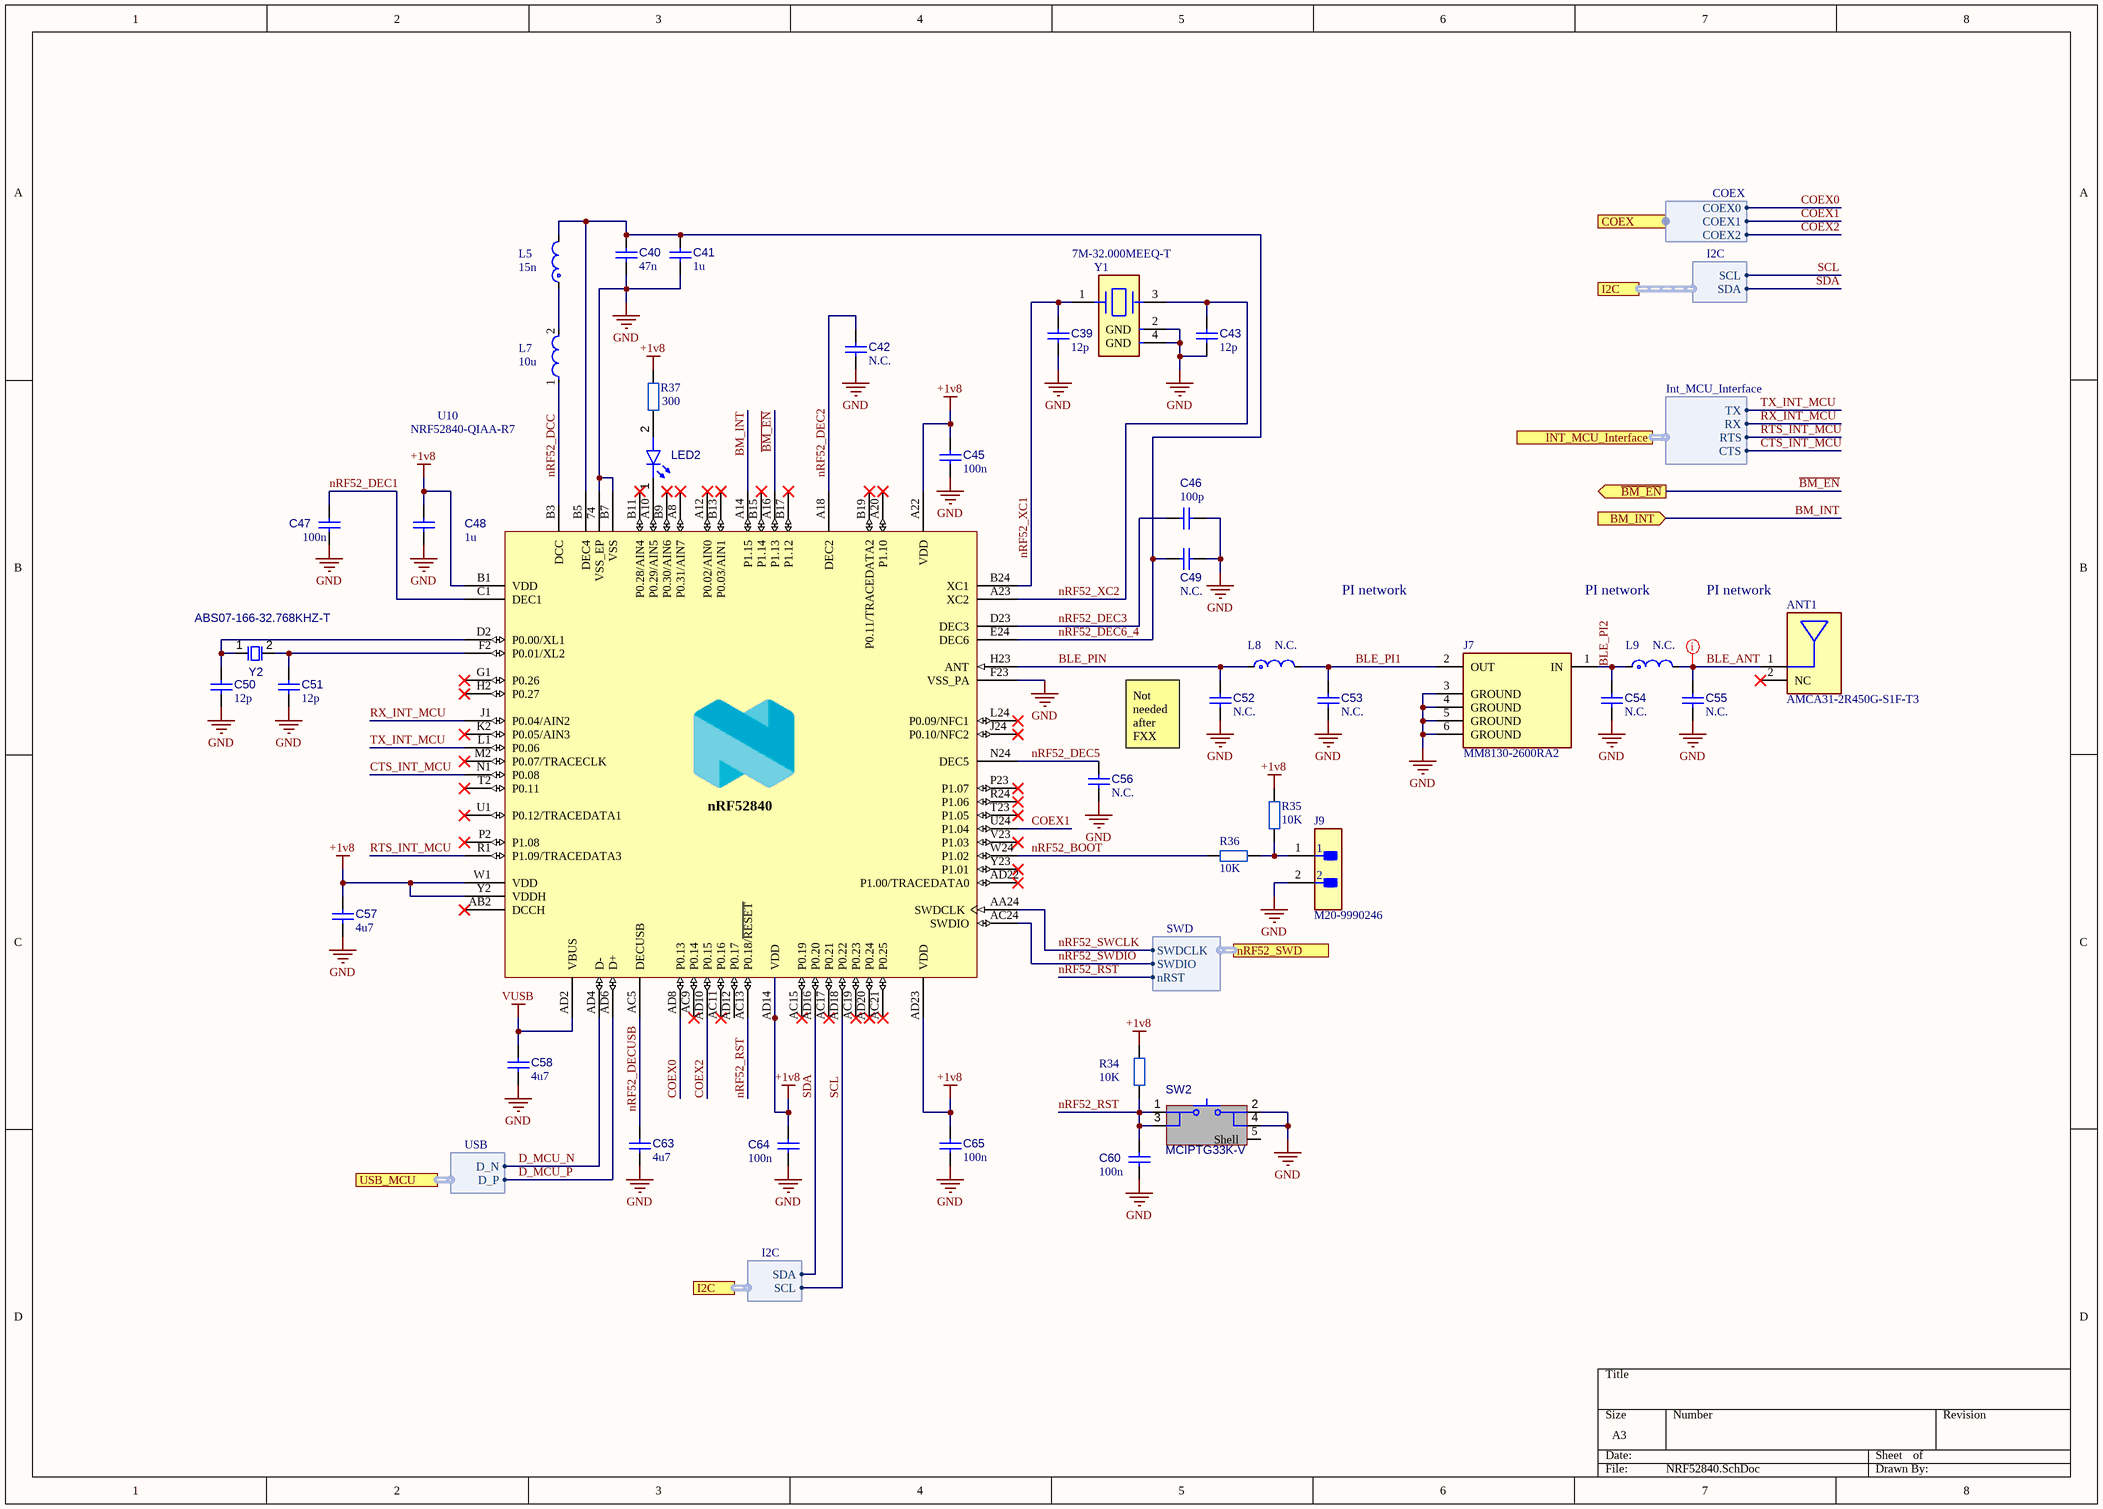
[diagram p3: NRF52840.SchDoc]

### Parts
ANT1  AMCA31-2R450G-S1F-T3  [FP-AMCA31-MFG]
C39  value 12p  [CAPC1005X55X25LL05T10 HD]  (hidden comment: Capacitor 0402)
C40  value 47n  [CAPC1005X55X25LL05T10 HD]  (hidden comment: Capacitor 0402)
C41  value 1u  [CAPC1005X55X25LL05T10 HD]  (hidden comment: Capacitor 0402)
C42  value N.C.  [CAPC1005X55X25LL05T10 HD]  (hidden comment: Capacitor 0402)
C43  value 12p  [CAPC1005X55X25LL05T10 HD]  (hidden comment: Capacitor 0402)
C45  value 100n  [CAPC1005X55X25LL05T10 HD]  (hidden comment: Capacitor 0402)
C46  value 100p  [CAPC1005X55X25LL05T10 HD]  (hidden comment: Capacitor 0402)
C47  value 100n  [CAPC1005X55X25LL05T10 HD]  (hidden comment: Capacitor 0402)
C48  value 1u  [CAPC1005X55X25LL05T10 HD]  (hidden comment: Capacitor 0402)
C49  value N.C.  [CAPC1005X55X25LL05T10 HD]  (hidden comment: Capacitor 0402)
C50  value 12p  [CAPC1005X55X25LL05T10 HD]  (hidden comment: Capacitor 0402)
C51  value 12p  [CAPC1005X55X25LL05T10 HD]  (hidden comment: Capacitor 0402)
C52  value N.C.  [CAPC1005X55X25LL05T10 HD]  (hidden comment: Capacitor 0402)
C53  value N.C.  [CAPC1005X55X25LL05T10 HD]  (hidden comment: Capacitor 0402)
C54  value N.C.  [CAPC1005X55X25LL05T10 HD]  (hidden comment: Capacitor 0402)
C55  value N.C.  [CAPC1005X55X25LL05T10 HD]  (hidden comment: Capacitor 0402)
C56  value N.C.  [CAPC1005X55X25LL05T10 HD]  (hidden comment: Capacitor 0402)
C57  value 4u7  [CAPC1005X55X25LL05T10 HD]  (hidden comment: Capacitor 0402)
C58  value 4u7  [CAPC1005X55X25LL05T10 HD]  (hidden comment: Capacitor 0402)
C60  value 100n  [CAPC1005X55X25LL05T10 HD]  (hidden comment: Capacitor 0402)
C63  value 4u7  [CAPC1005X55X25LL05T10 HD]  (hidden comment: Capacitor 0402)
C64  value 100n  [CAPC1005X55X25LL05T10 HD]  (hidden comment: Capacitor 0402)
C65  value 100n  [CAPC1005X55X25LL05T10 HD]  (hidden comment: Capacitor 0402)
J7  MM8130-2600RA2  [FP-MM8130-2600RA2-MFG]
J9  M20-9990246  [FP-M20-9990246-MFG]
L5  value 15n  [INDC1005X55X25LL05T10_A]  (hidden comment: Inductor 0402)
L7  value 10u  [FP-LQM18DN_70-MFG]  (hidden comment: Inductor 0603)
L8  value N.C.  [INDC1005X55X25LL05T10_A]  (hidden comment: Inductor 0402)
L9  value N.C.  [INDC1005X55X25LL05T10_A]  (hidden comment: Inductor 0402)
LED2  QBLP595-R  [QTB-QBLP595_V]  (value not drawn)
R34  value 10K  [RESC1005X40X25LL10T10 HD]  (hidden comment: Resistor 0403)
R35  value 10K  [RESC1005X40X25LL10T10 HD]  (hidden comment: Resistor 0403)
R36  value 10K  [RESC1005X40X25LL10T10 HD]  (hidden comment: Resistor 0403)
R37  value 300  [RESC1005X40X25LL10T10 HD]  (hidden comment: Resistor 0403)
SW2  MCIPTG33K-V  [MCIPTG33K-V-Footprint-1]
U10  NRF52840-QIAA-R7  [NRSC-AQFN-73]
Y1  7M-32.000MEEQ-T  [FP-7M-MFG]
Y2  ABS07-166-32.768KHZ-T  [EPSON-FC-135_V]

### Ports
BM_INT (in), COEX (harness COEX), I2C (harness I2C), INT_MCU_Interface (harness Int_MCU_Interface), nRF52_SWD (harness SWD), USB_MCU (harness USB), ~{BM_EN} (out)

### Harnesses
SWD: nRST, SWDCLK, SWDIO
USB: D_N, D_P
COEX: COEX2, COEX1, COEX0
I2C: SCL, SDA
I2C: SDA, SCL
Int_MCU_Interface: TX, RX, RTS, CTS

### Nets
+1v8: C45.2 C48.2 C57.2 C64.2 C65.2 R34.2 R35.1 R37.1 U10.A22(VDD) U10.AD14(VDD) U10.AD23(VDD) U10.B1(VDD) U10.W1(VDD) U10.Y2(VDDH)
GND: C39.1 C40.1 C41.1 C42.1 C43.1 C45.1 C46.1 C47.1 C48.1 C49.1 C50.1 C51.1 C52.1 C53.1 C54.1 C55.1 C56.1 C57.1 C58.1 C60.1 C63.1 C64.1 C65.1 J7.3(GROUND) J7.4(GROUND) J7.5(GROUND) J7.6(GROUND) J9.2 SW2.2 SW2.4 U10.74(VSS_EP) U10.B7(VSS) U10.F23(VSS_PA) Y1.2(GND) Y1.4(GND)
VUSB: C58.2 U10.AD2(VBUS)
~{BM_EN}: U10.A16(P1.13) ; port ~{BM_EN}
BLE_ANT: ANT1.1(Feed_Point) C55.2 L9.2
BLE_PI1: C53.2 J7.2(OUT) L8.2
BLE_PI2: C54.2 J7.1(IN) L9.1
BLE_PIN: C52.2 L8.1 U10.H23(ANT)
BM_INT: U10.A14(P1.15) ; port BM_INT
COEX0: U10.AD8(P0.13) ; port COEX.COEX0
COEX1: U10.U24(P1.04) ; port COEX.COEX1
COEX2: U10.AD10(P0.15) ; port COEX.COEX2
CTS_INT_MCU: U10.N1(P0.08) ; port INT_MCU_Interface.CTS
D_MCU_N: U10.AD4(D-) ; port USB_MCU.D_N
D_MCU_P: U10.AD6(D+) ; port USB_MCU.D_P
nRF52_BOOT: R36.2 U10.W24(P1.02)
nRF52_DCC: L7.1 U10.B3(DCC)
nRF52_DEC1: C47.2 U10.C1(DEC1)
nRF52_DEC2: C42.2 U10.A18(DEC2)
nRF52_DEC3: C46.2 U10.D23(DEC3)
nRF52_DEC5: C56.2 U10.N24(DEC5)
nRF52_DEC6_4: C40.2 C41.2 C49.2 L5.2 U10.B5(DEC4) U10.E24(DEC6)
nRF52_DECUSB: C63.2 U10.AC5(DECUSB)
nRF52_RST: C60.2 R34.1 SW2.1 SW2.3 U10.AC13(P0.18/~{RESET}) ; port nRF52_SWD.nRST
nRF52_SWCLK: U10.AA24(SWDCLK) ; port nRF52_SWD.SWDCLK
nRF52_SWDIO: U10.AC24(SWDIO) ; port nRF52_SWD.SWDIO
nRF52_XC1: C39.2 U10.B24(XC1) Y1.1
nRF52_XC2: C43.2 U10.A23(XC2) Y1.3
RTS_INT_MCU: U10.R1(P1.09/TRACEDATA3) ; port INT_MCU_Interface.RTS
RX_INT_MCU: U10.J1(P0.04/AIN2) ; port INT_MCU_Interface.RX
SCL: U10.AD18(P0.22) ; port I2C.SCL
SDA: U10.AD16(P0.20) ; port I2C.SDA
TX_INT_MCU: U10.L1(P0.06) ; port INT_MCU_Interface.TX
NetC50_2: C50.2 U10.D2(P0.00/XL1) Y2.1
NetC51_2: C51.2 U10.F2(P0.01/XL2) Y2.2
NetJ9_1: J9.1 R35.2 R36.1
NetL5_1: L5.1 L7.2
NetLED2_1: LED2.1(K) U10.A10(P0.29/AIN5)
NetLED2_2: LED2.2(A) R37.2

Not connected (* = marked no-connect by the designer): ANT1 2(NC)*; SW2 5(Shell); U10 A8(P0.31/AIN7)* A12(P0.02/AIN0)* A20(P1.10)* AB2(DCCH)* AC9(P0.14)* AC11(P0.16)* AC15(P0.19)* AC17(P0.21)* AC19(P0.23)* AC21(P0.25)* AD12(P0.17) AD20(P0.24)* AD22(P1.00/TRACEDATA0)* B9(P0.30/AIN6)* B11(P0.28/AIN4)* B13(P0.03/AIN1)* B15(P1.14)* B17(P1.12)* B19(P0.11/TRACEDATA2)* G1(P0.26)* H2(P0.27)* J24(P0.10/NFC2)* K2(P0.05/AIN3)* L24(P0.09/NFC1)* M2(P0.07/TRACECLK)* P2(P1.08)* P23(P1.07)* R24(P1.06)* T2(P0.11)* T23(P1.05)* U1(P0.12/TRACEDATA1)* V23(P1.03)* Y23(P1.01)*

### Layout directives
net class RF: BLE_ANT

### Notes on the sheet
- PI network
- Not needed after FXX
- (in symbol CMP-020-00024-2) nRF52840

### Library data of the parts
ANT1 = CMP-27836-000002-1: RF ANT 2.4GHZ CHIP SOLDER SMD; Manufacturer: Abracon; Power Rating: 3W; Max Frequency: 2450MHz; Impedance: 50Ω; Number Of Bands: 1; Bandwidth: 100MHz; RoHS: TRUE; ComponentLink2Description: Datasheet; Category: Ant; Temperature: -40°C to +85°C; Device Class L3: RF Antennas; Octopart: https://octopart.com/amca31-2r450g-s1f-t3-abracon-31435383; Manufacturer Part Number: AMCA31-2R450G-S1F-T3; Digikey Description: RF ANT 2.4GHZ CHIP SOLDER SMD; Package: AMCA31; Temperature Range High: +85°C; Automotive: No; Device Class L2: RF Semiconductors and Devices; ComponentLink2URL: https://abracon.com/chip-antenna/AMCA31-2R450G-S1F-T3.pdf; Temperature Range Low: -40°C; Device Class L1: Integrated Circuits (ICs); Lead Free: Yes; Height: 1.4mm; Mouser Description: Antennas 2.45GHz BW 90dB + Gain -1 dBi avg.
C39 C43 = CMP-001-00008-14: Chip Capacitor, 0402 (1005 Metric); Voltage Rating: ?V; Capacitor Type: Ceramic; Tolerance: ?%; Case/Package: 0402; Mounting Technology: SMT; Pins: 2
C40-C42 C45-C58 C60 C63-C65 = CMP-001-00008-14: as C19 on sheet Power; Case/Package: 0402; Pins: 2; Mounting Technology: SMT
J7 = CMP-000011-2: CONN SWF JACK STR 50 OHM SMD
J9 = CMP-15831-000009-1: as J8 on sheet NRF9160; ComponentLink2URL: https://cdn.harwin.com/pdfs/M20-999.pdf; ComponentLink2Description: Datasheet; Package: M20-9990246; Temperature: -40°C to +105°C; Octopart: https://octopart.com/m20-9990246-harwin-2590635; Mouser Description: 2.54mm (0.1") Pitch SIL Vertical PC Tail Pin Header, 6.1mm mating pin height, tin, 2 contacts; Temperature Range High: +105°C; Device Class L1: Connectors; RoHS: TRUE; Automotive: No; Height: 8.99mm; Number Of Rows: 1; Contact Material: Tin,Nickel; Category: Conn; Pitch: 2.54mm; Lead Free: Yes; Digikey Description: CONN HEADER VERT 2POS 2.54MM; Manufacturer Part Number: M20-9990246; Temperature Range Low: -40°C; Device Class L3: unset; Device Class L2: Headers and Wire Housings
L5 L8 L9 = CMP-000000-6: as L1 on sheet NRF9160; Pins: 2
  L5: Inductance: 15n
  L8 L9: Inductance: N.C.
L7 = CMP-000001-5: Inductor 0603 Multilayer; Current Rating: ?A; Voltage Rating: ?V; Package: 0603
LED2 = CMP-007-00040-3: as LED1 on sheet Power; Colour: Red; RoHS Compliant: Yes; Case/Package: 0402; Pins: 2; Mounting Technology: SMT
R34-R37 = CMP-009-00178-4: Package: 0403; Design Item ID: Resistor EU; Source: Moto Symbol Lib.SchLib
SW2 = CMP-011-00014-2: as SW1 on sheet NRF9160; ComponentLink1URL: https://www.farnell.com/datasheets/3167256.pdf; ComponentLink1Description: Link
U10 = CMP-020-00024-2: Advanced multi-protocol SoC supporting Bluetooth 5/ANT/ 802.15.4/ 2.4GHz proprietary
Y1 = CMP-003-00030-1: Crystal 32MHz ±10ppm (Tol) ±10ppm (Stability) 10pF FUND 50Ohm 4-Pin SMD T/R
Y2 = CMP-003-00029-1: Crystal 32.768kHz 10ppm 7pF -40C +85C; Pins: 2; Frequency: 32.768kHz

## Sheet Sensors and peripherals.SchDoc
size A3; SheetNumber: 4; SheetTotal: 6
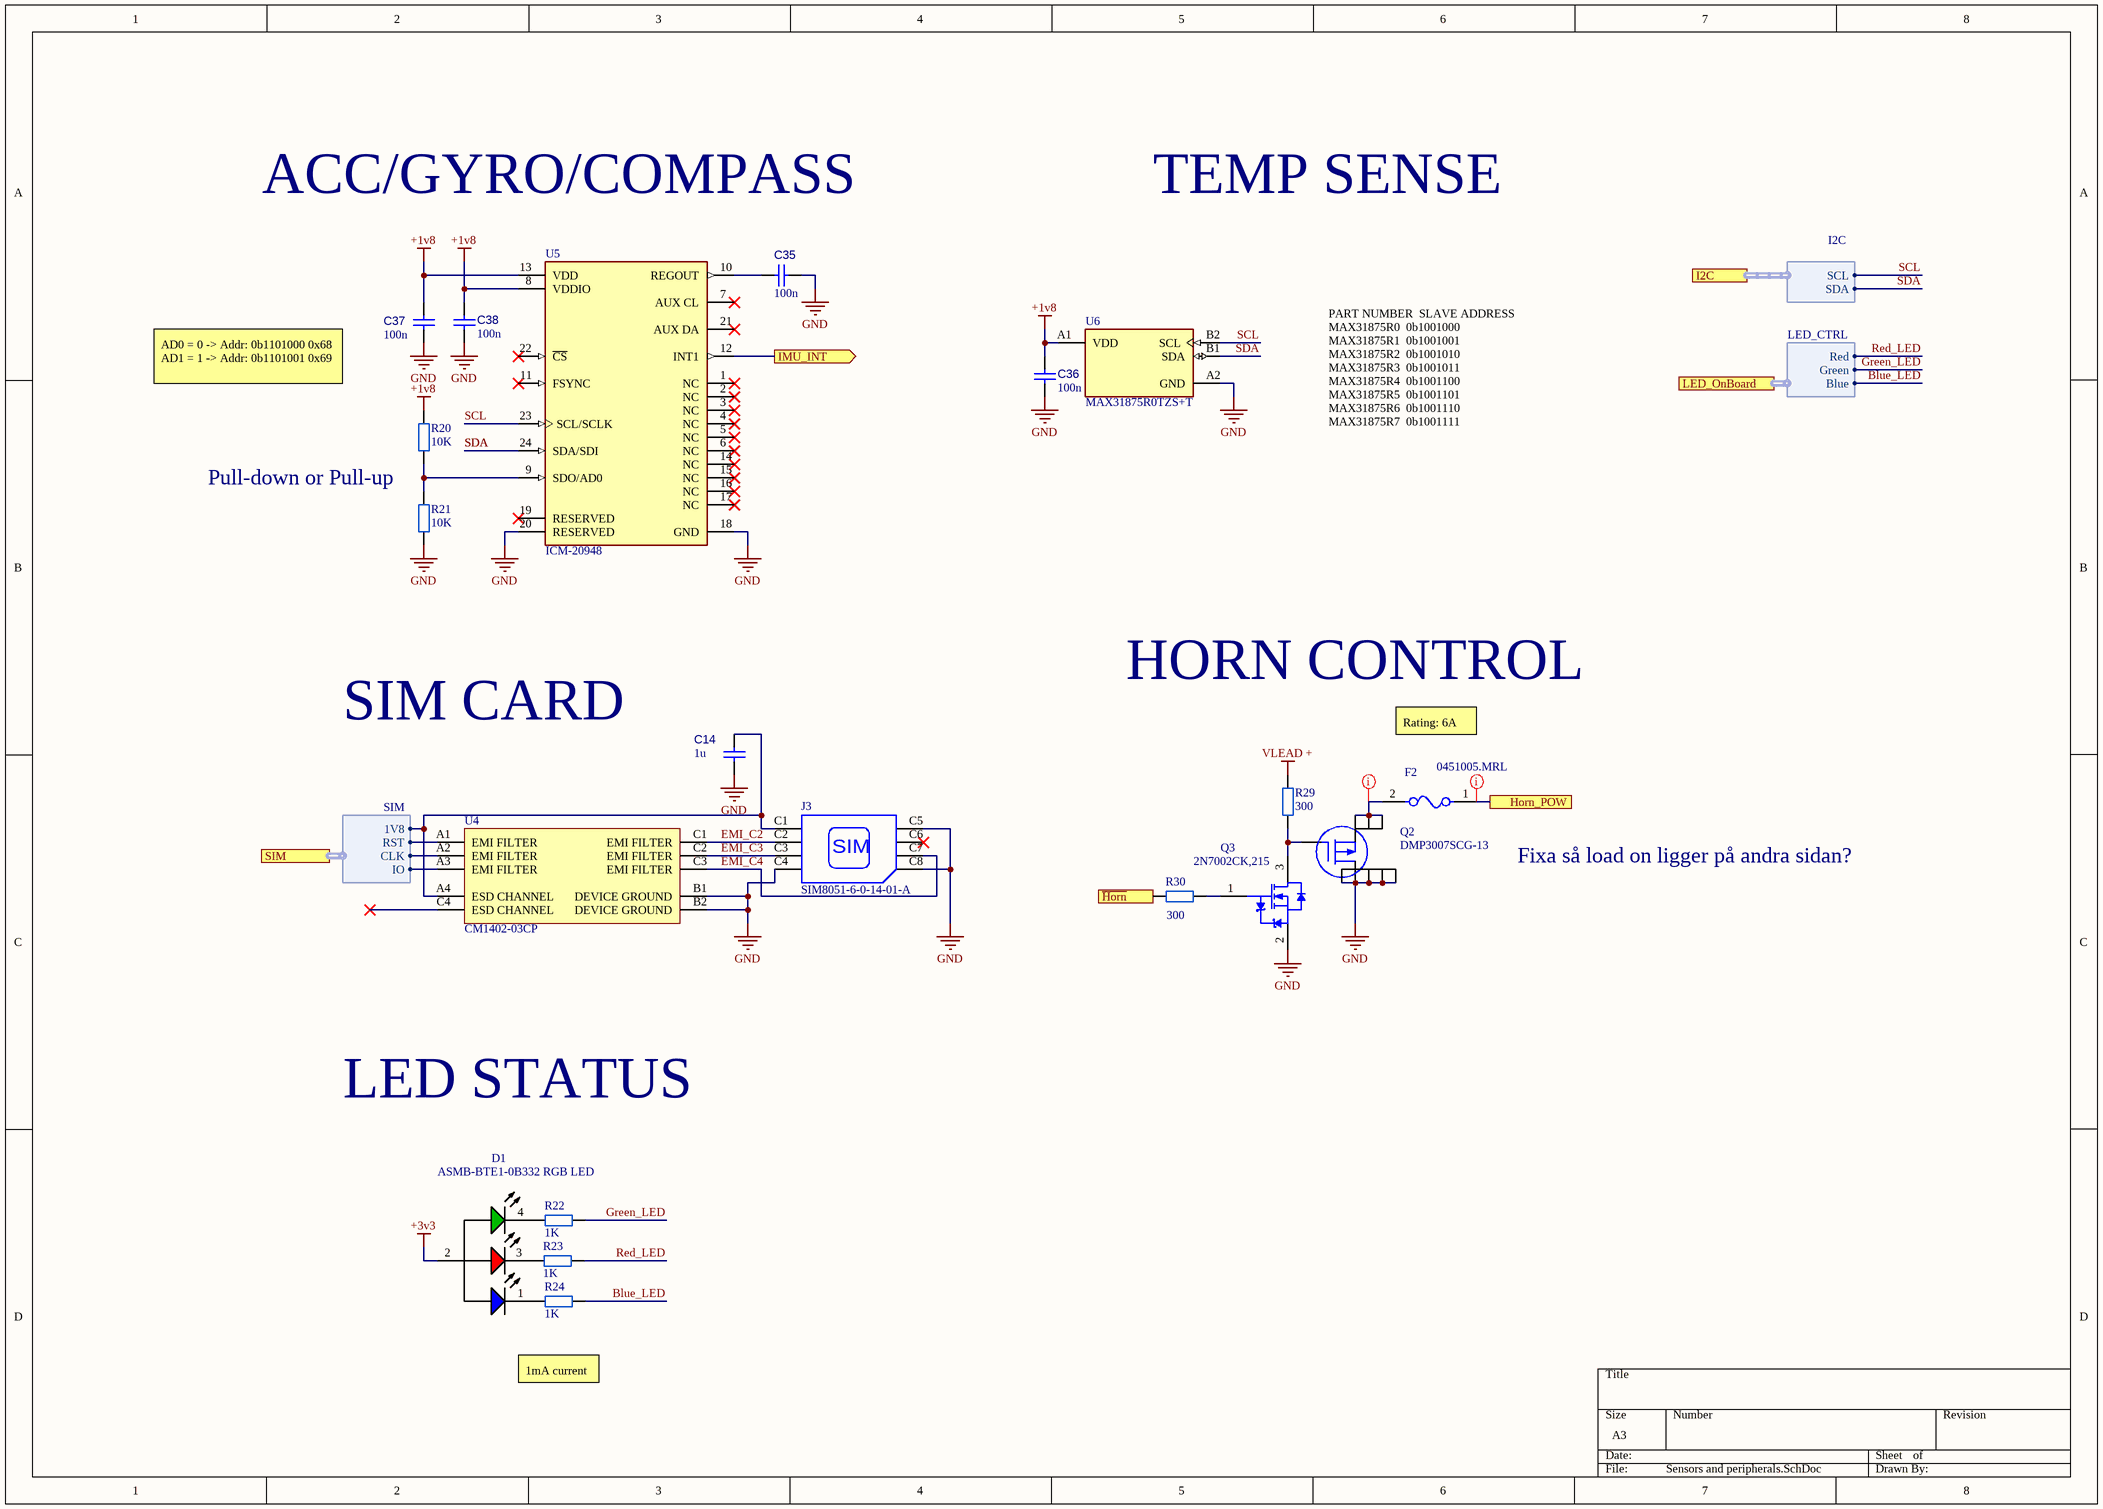
[diagram p4: Sensors and peripherals.SchDoc]

### Parts
C14  value 1u  [CAPC1608X90X40LL10T20 HD]  (hidden comment: Capacitor 0603)
C35  value 100n  [CAPC1005X55X25LL05T10 HD]  (hidden comment: Capacitor 0402)
C36  value 100n  [CAPC1005X55X25LL05T10 HD]  (hidden comment: Capacitor 0402)
C37  value 100n  [CAPC1005X55X25LL05T10 HD]  (hidden comment: Capacitor 0402)
C38  value 100n  [CAPC1005X55X25LL05T10 HD]  (hidden comment: Capacitor 0402)
D1  ASMB-BTE1-0B332 RGB LED  [FP-ASMB-BTE1-0B332-MFG]
F2  0451005.MRL  [FP-0451-MFG]
J3  SIM8051-6-0-14-01-A  [FP-SIM8051-6-0-14-01-A-MFG]
Q2  DMP3007SCG-13  [DMP3007SCG13]
Q3  2N7002CK,215  [NXP-SOT23_N]
R20  value 10K  [RESC1005X40X25LL10T10 HD]  (hidden comment: Resistor 0403)
R21  value 10K  [RESC1005X40X25LL10T10 HD]  (hidden comment: Resistor 0403)
R22  value 1K  [RESC1005X40X25LL10T10 HD]  (hidden comment: Resistor 0403)
R23  value 1K  [RESC1005X40X25LL10T10 HD]  (hidden comment: Resistor 0403)
R24  value 1K  [RESC1005X40X25LL10T10 HD]  (hidden comment: Resistor 0403)
R29  value 300  [RESC1608X55X25ML10T15]  (hidden comment: Resistor 0603)
R30  value 300  [RESC1608X55X25ML10T15]  (hidden comment: Resistor 0603)
U4  CM1402-03CP  [ONSC-WLCSP-10-567BL-01]
U5  ICM-20948  [FP-ICM-20948-IPC_A]
U6  MAX31875R0TZS+T  [FP-Z40C0-1-MFG]

### Ports
Horn_POW, I2C (harness I2C), IMU_INT (out), LED_OnBoard (harness LED_CTRL), SIM (harness SIM), ~{Horn} (in)

### Harnesses
I2C: SCL, SDA
SIM: 1V8, RST, CLK, IO
LED_CTRL: Red, Green, Blue

### Nets
+1v8: C36.2 C37.2 C38.2 R20.2 U5.8(VDDIO) U5.13(VDD) U6.A1(VDD)
+3v3: D1.2(Common_Anode)
GND: C14.1 C35.1 C36.1 C37.1 C38.1 J3.C4(SHLD) J3.C5(GND) J3.C8(SHLD) Q2.5(D) Q2.6(D) Q2.7(D) Q2.8(D) Q2.9(D) Q3.2(S) R21.1 U4.B1(DEVICE_GROUND) U4.B2(DEVICE_GROUND) U5.18(GND) U5.20(RESERVED) U6.A2(GND)
VLEAD +: R29.2
Blue_LED: R24.1 ; port LED_OnBoard.Blue
EMI_C2: J3.C2(RST) U4.C1(EMI_FILTER)
EMI_C3: J3.C3(CLK) U4.C2(EMI_FILTER)
EMI_C4: J3.C7(I/O) U4.C3(EMI_FILTER)
Green_LED: R22.1 ; port LED_OnBoard.Green
~{Horn}: R30.1 ; port ~{Horn}
INT_IMU: U5.12(INT1) ; port IMU_INT
Red_LED: R23.1 ; port LED_OnBoard.Red
SCL: U5.23(SCL/SCLK) U6.B2(SCL) ; port I2C.SCL
SDA: U5.24(SDA/SDI) U6.B1(SDA) ; port I2C.SDA
SIM_1V8: C14.2 J3.C1(VCC) U4.A4(ESD_CHANNEL) ; port SIM.1V8
SIM_CLK: U4.A2(EMI_FILTER) ; port SIM.CLK
SIM_IO: U4.A3(EMI_FILTER) ; port SIM.IO
SIM_RST: U4.A1(EMI_FILTER) ; port SIM.RST
NetC35_2: C35.2 U5.10(REGOUT)
NetD1_1: D1.1(Cathode(Blue)) R24.2
NetD1_3: D1.3(Cathode(Red)) R23.2
NetD1_4: D1.4(Cathode(Green)) R22.2
NetE1_A1: F2.1 ; port Horn_POW
NetF2_2: F2.2 Q2.1(S) Q2.2(S) Q2.3(S)
NetQ2_4: Q2.4(G) Q3.3(D) R29.1
NetQ3_1: Q3.1(G) R30.2
NetR20_1: R20.1 R21.2 U5.9(SDO/AD0)

Not connected (* = marked no-connect by the designer): J3 C6(VPP)*; U4 C4(ESD_CHANNEL)*; U5 1(NC)* 2(NC)* 3(NC)* 4(NC)* 5(NC)* 6(NC)* 7(AUX_CL)* 11(FSYNC)* 14(NC)* 15(NC)* 16(NC)* 17(NC)* 19(RESERVED)* 21(AUX_DA)* 22(~{CS})*

### Layout directives
net class High Power; rule Supply Nets [Voltage = 14.00]: NetE1_A1
net class High Power: NetF2_2

### Notes on the sheet
- ACC/GYRO/COMPASS
- TEMP SENSE
- AD0 = 0 -> Addr: 0b1101000 0x68
  AD1 = 1 -> Addr: 0b1101001 0x69
- PART NUMBER 	SLAVE ADDRESS
  MAX31875R0 	0b1001000
  MAX31875R1 	0b1001001
  MAX31875R2 	0b1001010
  MAX31875R3 	0b1001011
  MAX31875R4 	0b1001100
  MAX31875R5 	0b1001101
  MAX31875R6 	0b1001110
  MAX31875R7 	0b1001111
- Pull-down or Pull-up
- HORN CONTROL
- SIM CARD
- Rating: 6A
- Fixa så load on ligger på andra sidan?
- LED STATUS
- 1mA current
- (in symbol CMP-002-00073-2) SIM

### Library data of the parts
C14 = CMP-001-00014-13: as C1 on sheet Power; Max Operating Temperature: Ceramic; Pins: 2; Case/Package: 0603; Mounting Technology: SMT
C35-C38 = CMP-001-00008-14: as C19 on sheet Power; Case/Package: 0402; Pins: 2; Mounting Technology: SMT
D1 = CMP-005-000000-1: LED RGB DIFFUSED 4PLCC SMD; Manufacturer: Broadcom; Forward Voltage: 3.1/3.1/2.1V; Wavelength: 469/529/622nm; Led Orientation: Top View; Peak Emmision Wavelength: 464/521/629nm; Power Dissipation: 90/90/78mW; Forward Current: 20mA; Reverse Voltage: 4V; Max Junction Temp: +110°C; Viewing Angle: 110°; Luminous Intensity: 350/1500/630mcd; Colour: Blue, Green, Red; Device Class L2: LEDs; Package: 0; Manufacturer Part Number: ASMB-BTE1-0B332; Category: Diode; Lead Free: Yes; Device Class L1: Optoelectronics; Temperature: -40°C to +100°C; Design Item ID: ASMB-BTE1-0B332 RGB LED; RoHS: TRUE; Octopart: https://octopart.com/asmb-bte1-0b332-broadcom-71127192; Automotive: No; Device Class L3: unset; Digikey Description: LED RGB DIFFUSED 4PLCC SMD; Height: 2.1mm; Temperature Range Low: -40°C; Temperature Range High: +100°C; Source: Moto Symbol Lib.SchLib
F2 = CMP-2000-05653-2: as F1 on sheet Power; Device Class L3: unset; Temperature Range Low: -55°C; Height: 2.94mm; Category: Fuse; Fuse Current: 5A; Octopart: https://octopart.com/0451005.mrl-littelfuse-566389; Package: 0451; RoHS: TRUE; Manufacturer Part Number: 0451005.MRL; Mouser Description: Surface Mount Fuses 125V 5A; Device Class L2: Fuses; ComponentLink2URL: https://www.littelfuse.com/~/media/electronics/datasheets/fuses/littelfuse_fuse_451_453_datasheet.pdf.pdf; Temperature Range High: +125°C; Digikey Description: FUSE BRD MNT 5A 125VAC/VDC 2SMD; Device Class L1: Circuit Protection; Automotive: No; Fuse Interrupt Dc Current: 50A; Temperature: -55°C to +125°C; Max Fuse Dc Voltage: 125V; Resistance: 0.0125Ω; ComponentLink2Description: Datasheet; Max Fuse Ac Voltage: 125V; Lead Free: Yes
J3 = CMP-002-00073-2: Push-Pull 6P 1.35mmH 3µ" gold with peg and logo Nano SIM Card Connector
Q2 = CMP-028-000000-2: as Q1 on sheet Power; Source: Moto Symbol Lib.SchLib; Height: 0.85mm; Mouser Price/Stock: https://www.mouser.co.uk/ProductDetail/Diodes-Incorporated/DMP3007SCG-13?qs=lqAf%2FiVYw9j1j9A9Mlh%252Bjg%3D%3D; Design Item ID: DMP3007SCG-13; Manufacturer_Part_Number: DMP3007SCG-13; Arrow Price/Stock: https://www.arrow.com/en/products/dmp3007scg-13/diodes-incorporated; Arrow Part Number: DMP3007SCG-13; Mouser Part Number: 621-DMP3007SCG-13; Datasheet Link: https://componentsearchengine.com/Datasheets/1/DMP3007SCG-13.pdf
Q3 = CMP-1259-00088-1: N-Channel Trench MOSFET, 60 V, 0.3 A, -55 to 150 degC, 3-Pin SOT23, Tape and Reel; Manufacturer: NXP Semiconductors; Channel Type: N; Packing: Tape & Reel; VGSth [typ] (V): 1.75; Automotive Qualified: Y; ID [max] (A): 0.3; IDM [max] (A): 1.2; VDS [max] (V): 60; DatasheetVersion: Rev. 01; ComponentLink3URL: http://www.nxp.com/documents/outline_drawing/sot023_po.pdf; PackageVersion: 06-03-16, 03/2006; ComponentLink3Description: Package Specification; ComponentLink1Description: Manufacturer URL; Mounting Technology: Surface Mount; ComponentLink1URL: http://www.nxp.com/; Code_JEDEC: TO-236AB; ComponentLink2URL: http://www.nxp.com/documents/data_sheet/2N7002CK.pdf; PackageDescription: 3-Pin Small Outline Transistor Package, Body 2.9 x 1.3 mm, Pitch 0.95 mm; PackageReference: SOT23; PartNumber: 2N7002CK,215; ComponentLink2Description: Datasheet
R20-R24 = CMP-009-00178-4: Package: 0403; Design Item ID: Resistor EU; Source: Moto Symbol Lib.SchLib
R29 R30 = CMP-009-000000-4: Design Item ID: Resistor EU; Source: Moto Symbol Lib.SchLib
U4 = CMP-1066-00070-1: SIM Card EMI Filter Array with ESD Protection, -40 to 85 degC, 10-Pin WLCSP, Pb-Free, Tape and Reel; Manufacturer: On Semiconductor; C Typ (pF): 20; Number of Lines: 4; ComponentLink3Description: Package Specification; PackageDescription: 10-Ball Wafer Level Chip Scale Package, Body 1.96 x 1.33 mm; PartNumber: CM1402-03CP; ComponentLink1URL: http://www.onsemi.com/; PackageReference: WLCSP-10-567BL-01; ComponentLink1Description: Manufacturer URL; RoHS: Pb-Free; Mounting Technology: Surface Mount; ComponentLink3URL: http://www.onsemi.com/pub_link/Collateral/567BL.PDF; ComponentLink2URL: http://www.onsemi.com/pub_link/Collateral/CM1402-D.PDF; PackageVersion: Rev. O, 07/2010; Packing: Tape and Reel; DatasheetVersion: Rev. 4; ComponentLink2Description: Datasheet
U5 = CMP-000008-2: IMU ACCEL/GYRO/COMPI2C/SPI 24QFN
U6 = CMP-010-00024-1: The MAX31875 is a ±1°C-Accurate Local Temperature Sensor with I2C/SMBus Interface.

## Sheet Connectors.SchDoc
size A4; SheetNumber: 5; SheetTotal: 6
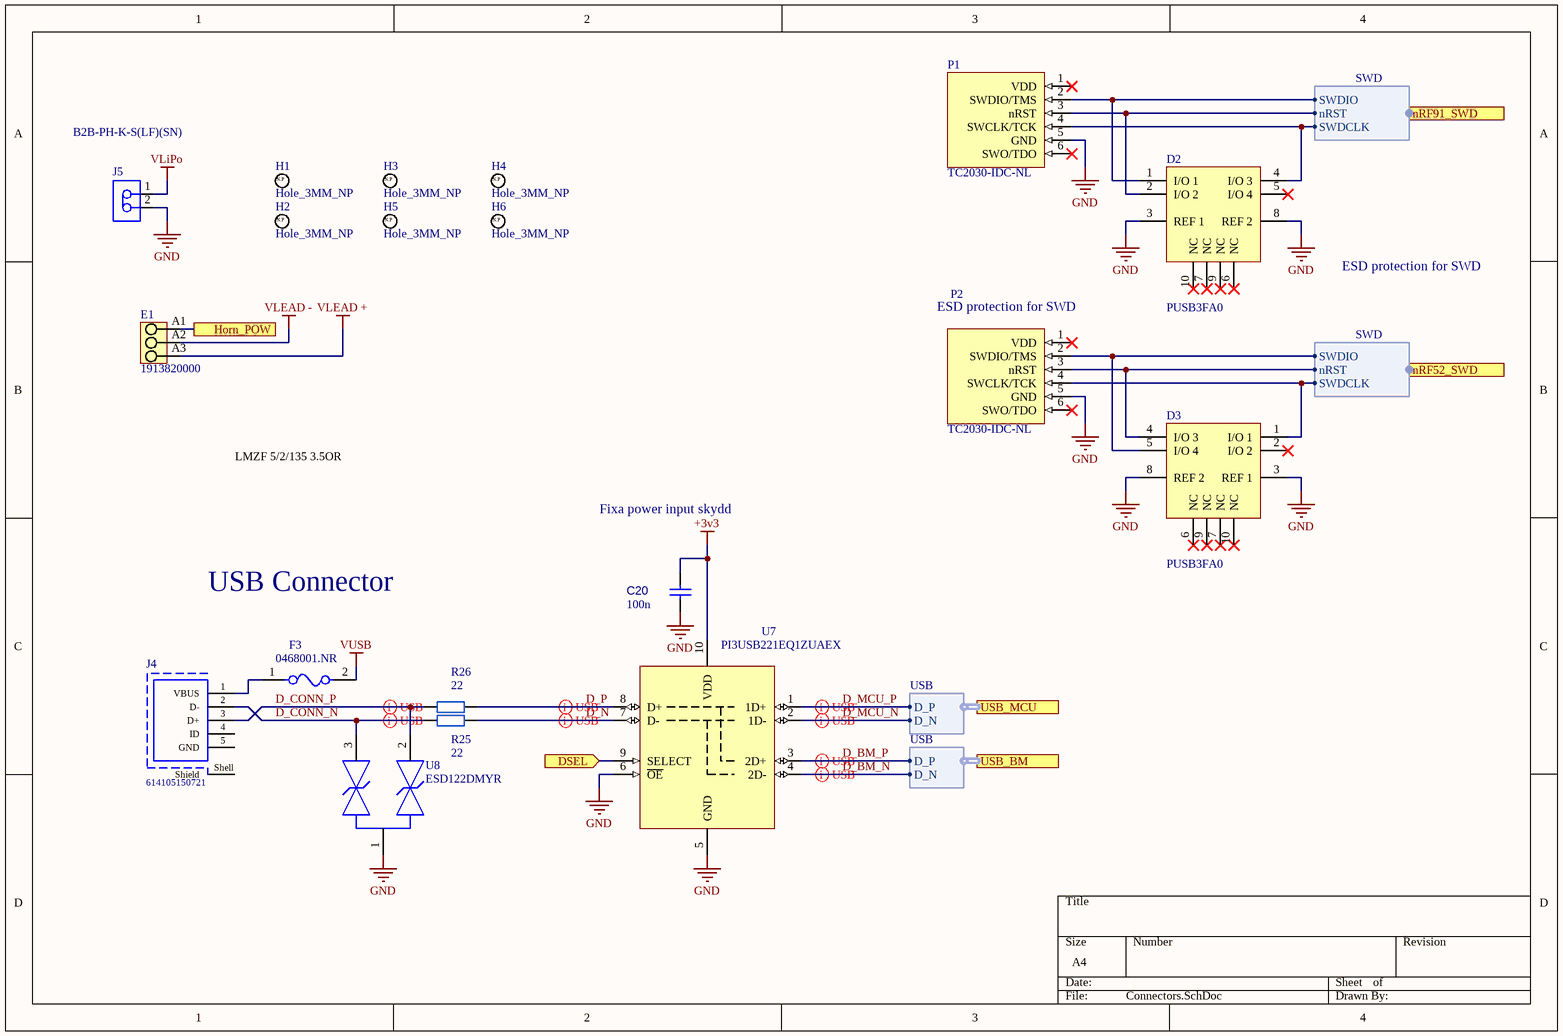
[diagram p5: Connectors.SchDoc]

### Parts
C20  value 100n  [CAPC1005X55X25LL05T10 HD]  (hidden comment: Capacitor 0402)
D2  PUSB3FA0  [FP-SOT1176-1-MFG]
D3  PUSB3FA0  [FP-SOT1176-1-MFG]
E1  1913820000  [LMZF_5_135_03]
F3  0468001.NR  [FP-0468-MFG]
H1  Hole_3MM_NP  [Hole_3MM_NP-Footprint-1]  (no BOM)
H2  Hole_3MM_NP  [Hole_3MM_NP-Footprint-1]  (no BOM)
H3  Hole_3MM_NP  [Hole_3MM_NP-Footprint-1]  (no BOM)
H4  Hole_3MM_NP  [Hole_3MM_NP-Footprint-1]  (no BOM)
H5  Hole_3MM_NP  [Hole_3MM_NP-Footprint-1]  (no BOM)
H6  Hole_3MM_NP  [Hole_3MM_NP-Footprint-1]  (no BOM)
J4  614105150721  [614105150721]
J5  B2B-PH-K-S(LF)(SN)  [JST-B2B-PH-K-S_V]
P1  TC2030-IDC-NL  [New footprint 1]
P2  TC2030-IDC-NL  [New footprint 1]
R25  value 22  [RESC1005X40X25LL10T10 HD]  (hidden comment: Resistor 0403)
R26  value 22  [RESC1005X40X25LL10T10 HD]  (hidden comment: Resistor 0403)
U7  PI3USB221EQ1ZUAEX  [PI3USB221EQ1ZUAEX-Footprint-1]
U8  ESD122DMYR  [FP-DMY0003A-MFG]

### Ports
DSEL (in), Horn_POW, nRF52_SWD (harness SWD), nRF91_SWD (harness SWD), USB_BM (harness USB), USB_MCU (harness USB)

### Harnesses
SWD: SWDIO, SWDCLK, nRST
USB: D_P, D_N

### Nets
+3v3: C20.2 U7.10(VDD)
GND: C20.1 D2.3(REF_1) D2.8(REF_2) D3.3(REF_1) D3.8(REF_2) J5.2 P1.5(GND) P2.5(GND) U7.5(GND) U7.6(~{OE}) U8.1(GND)
VLEAD +: E1.A3
VLEAD -: E1.A2
VLIPO: J5.1
VUSB: F3.2
D_BM_N: U7.4(2D-) ; port USB_BM.D_N
D_BM_P: U7.3(2D+) ; port USB_BM.D_P
D_CONN_N: J4.2(D-) R25.1 U8.3(IO2)
D_CONN_P: J4.3(D+) R26.1 U8.2(IO1)
D_MCU_N: U7.2(1D-) ; port USB_MCU.D_N
D_MCU_P: U7.1(1D+) ; port USB_MCU.D_P
D_N: R25.2 U7.7(D-)
D_P: R26.2 U7.8(D+)
DSEL: U7.9(SELECT) ; port DSEL
nRF52_RST: D3.4(I/O_3) P2.3(nRST) ; port nRF52_SWD.nRST
nRF52_SWCLK: D3.1(I/O_1) P2.4(SWCLK/TCK) ; port nRF52_SWD.SWDCLK
nRF52_SWDIO: D3.5(I/O_4) P2.2(SWDIO/TMS) ; port nRF52_SWD.SWDIO
nRF91_RST: D2.2(I/O_2) P1.3(nRST) ; port nRF91_SWD.nRST
NetD2_1: D2.1(I/O_1) P1.2(SWDIO/TMS) ; port nRF91_SWD.SWDIO
NetD2_4: D2.4(I/O_3) P1.4(SWCLK/TCK) ; port nRF91_SWD.SWDCLK
NetE1_A1: E1.A1 ; port Horn_POW
NetF3_1: F3.1 J4.1(VBUS)

Not connected (* = marked no-connect by the designer): D2 5(I/O_4)* 6(NC)* 7(NC)* 9(NC)* 10(NC)*; D3 2(I/O_2)* 6(NC)* 7(NC)* 9(NC)* 10(NC)*; H1 1; H2 1; H3 1; H4 1; H5 1; H6 1; J4 4(ID) 5(GND) Shell(Shield); P1 1(VDD)* 6(SWO/TDO)*; P2 1(VDD)* 6(SWO/TDO)*

### Layout directives
differential pair; differential pair class USB; net class USB: D_BM_N, D_BM_P, D_CONN_N, D_CONN_P, D_MCU_N, D_MCU_P, D_N, D_P

### Notes on the sheet
- (near P2) ESD protection for SWD
- ESD protection for SWD
- LMZF 5/2/135 3.5OR
- Fixa power input skydd
- USB Connector
- (in symbol CMP-022-000001-2) N.P

### Library data of the parts
C20 = CMP-001-00008-10: Chip Capacitor, 0402 (1005 Metric); Tolerance: ?%; Capacitor Type: Ceramic; Voltage Rating: ?V; Case/Package: 0402; Pins: 2; Mounting Technology: SMT
D2 D3 = CMP-001-0001-2: ESD protection for ultra high-speed interfaces; ComponentLink1Description: Datasheet; ComponentLink1URL: https://assets.nexperia.com/documents/data-sheet/PUSB3FA0.pdf
E1 = CMP-1559-01899-1: OMNIMATE Signal - series LMZF; Manufacturer: Weidmueller; Insulating_material: Wemid (PA); No_of_poles: 3; Contact_surface: tinned; Contact_material: E-Cu; Solid_min_H05_07_V_U: 0,13 mm²; Solid_max_H05_07_V_U: 2,5 mm²; Wire_cross_section_AWG_min_UL_1059: AWG 26; Pitch_inch: 0,197 inch; Wire_cross_section_AWG_max_UL_1059: AWG 14; Short_text_for_material: LMZF 5/3/135 3.5OR; UL_94_flammability_rating: V-0; Rated_current_use_group_B_UL_1059: 15 A; Rated_voltage_use_group_B_UL_1059: 300 V; Side_termination_characteristic: closed side; Pitch_mm: 5 mm; Rated_voltage_for_surge_voltage_class_pollution_degree_II_2: 630 V; Solder_pin_length_mm: 3,5 mm; Mounting_onto_the_PCB: Solder connection; ComponentLink2URL: http://catalog.weidmueller.com/catalog/Start.do?localeId=en&ObjectID=1913820000; Colour: Orange; Revision: V1; Qty: 100 PCS; Packaging: Box; PackageReference: LMZF_5_135_03; ComponentLink1Description: Manufacturer URL; PartNumber: 1913820000; ComponentLink1URL: http://www.weidmueller.com/; ComponentLink2Description: URL Link1
F3 = CMP-2000-05753-2: FUSE BOARD MNT 1A 63VAC/VDC 1206; Manufacturer: Littelfuse; Fuse Interrupt Dc Current: 50A; Fuse I2T: 0.127A2Sec; Max Fuse Ac Voltage: 63V; Fuse Blow Speed: Slow; Resistance: 0.079Ω; Value: 0.079Ω; Fuse Voltage Drop: 94.7mV; Temperature: -55°C to +90°C; Automotive: No; Height: 0.762mm; Octopart: https://octopart.com/0468001.nr-littelfuse-566477; Device Class L1: Circuit Protection; Digikey Description: FUSE BOARD MNT 1A 63VAC/VDC 1206; ComponentLink2Description: Datasheet; Temperature Range Low: -55°C; Mouser Description: Surface Mount Fuses 1A Slo-Blo; Fuse Interrupt Ac Current: 50A; Max Fuse Dc Voltage: 63V; Fuse Current: 1A; RoHS: TRUE; Temperature Range High: +90°C; Category: Fuse; ComponentLink2URL: https://m.littelfuse.com/~/media/electronics/datasheets/fuses/littelfuse_fuse_468_datasheet.pdf.pdf; Package: 0468; Device Class L3: unset; Voltage Rating: 63V; Device Class L2: Fuses; Manufacturer Part Number: 0468001.NR; Lead Free: Yes
H1-H6 = CMP-022-000001-2: Regular Non-Plated, 3mm hole; Part number IPS: N.A.; Manufacturer: Nordic Semiconductor; Value: 3mm,N.P; Pad Count: 1; Design Item ID: Hole_3MM_NP; Part Number: Hole_3MM_NP; Published: 2009-12-12; Manufacturer Part Number: N.A.; ComponentLink2Description: Supplier link; HelpURL: N.A.; PartId: 100500145; Pin Count: 1; Footprint Doc: Hole_3MM_NP; Artikkelnr Noca: N.A.; LatestRevisionDate: 2009-12-12; Component Class: Connectors; ComponentLink1URL: N.A.; Source: pca20035.SCHLIB; ComponentLink1Description: Datasheet; ComponentLink2URL: N.A.; Component Type: Standard (No BOM); Note: Regular Non-Plated, 3mm hole
J4 = CMP-1502-03250-1: Micro USB 2.0 Type B Receptacle WR-COM, Vertical, THT; Manufacturer: Wurth Elektronik; Working Voltage: 30VAC; Contact Resistance: 30mOhm; Rated Current: 1.8A; Orientation: Vertical; Package Reference: 614105150721; Operating Temperature: -40to85degC; Publisher: WurthElektronik; Part Number: 614105150721; Mounting Technology: THT; Manufacturer URL: http://www.we-online.de; Connector Type: MicroUSB2.0TypeB; Packaging: TapeandReel; Gender: Receptacle; Datasheet URL: https://katalog.we-online.de/em/datasheet/614105150721.pdf
J5 = CMP-2000-05162-1: Male Header, Pitch 2 mm, 1 x 2 Position, Height 6 mm, Tail Length 3.4 mm, -25 to 85 degC, RoHS, Bulk; Manufacturer: JST; Pitch: 2mm; Style/Orientation: StraightHeader/Plug; No of Positions: 2; Datasheet Version: Nov-08; Datasheet URL: http://datasheet.octopart.com/B2B-PH-K-S%28LF%29%28SN%29-JST-datasheet-8324864.pdf; Manufacturer URL: http://www.jst.com/home2.html; Type: ShroudedHeader; Termination: Crimp
P1 P2 = CMP-002-00072-1: The TC2030-IDC-NL is our “No Legs” 6-pin Plug-of-Nails™ programming cable fitted with a 6-pin 0.1″ pitch ribbon connector.; ComponentLink1Description: Link; ComponentLink1URL: https://www.tag-connect.com/product/tc2030-idc-nl?fbclid=IwAR1tgnLH4nUig5e5nqm2vOLKgKeHrLJDpX61UscnRNookxhlbYr0vcLwdls
R25 R26 = CMP-009-00178-3: Package: 0403; Design Item ID: Resistor EU; Source: Moto Symbol Lib.SchLib
U7 = CMP-015-00008-3: High-Speed USB2.0 1:2 Multiplexer/DeMultiplexer Switch with Signal Enable; ComponentLink1URL: https://4donline.ihs.com/images/VipMasterIC/IC/DIOD/DIOD-S-A0012930327/DIOD-S-A0012956463-1.pdf?hkey=6D3A4C79FDBF58556ACFDE234799DDF0; ComponentLink1Description: Datasheet
U8 = CMP-04985-000020-1: TVS DIODE 3.6V 8.4V 3X2SON; Min Breakdown Voltage: 5.1V; Number of Bidirectional Channels: 2; Power Line Protection: No; Peak Pulse Current: 2.5A; Interface: USB; Peak Pulse Power: 20W; Packaging: Tape and Reel; Clamping Voltage: 8.4V; Number of Pins: 3; Reverse Standoff Voltage: 3.6V; Mount: Surface Mount; Min Operating Temperature: -40°C; Number of Channels: 2; RoHS Compliant: Yes; Max Operating Temperature: 125°C; Resistor Type: Zener